# Altium project HyperDrive.PrjPcb (part 1 of 2)
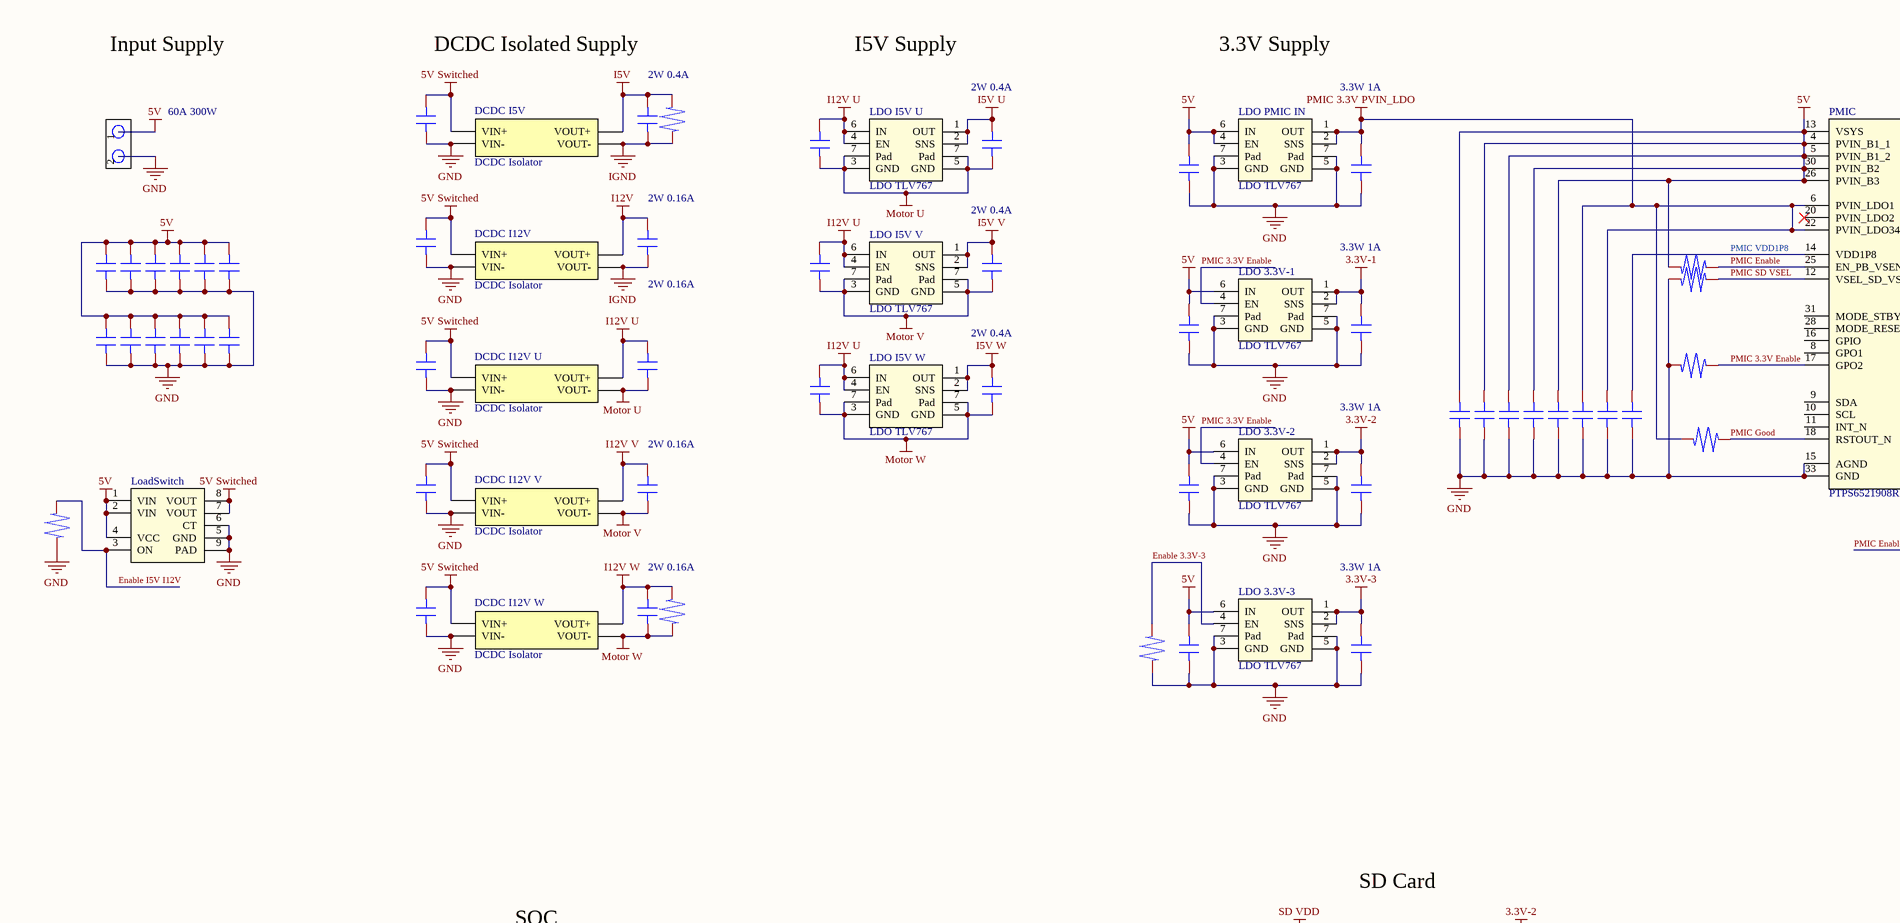
[diagram p0: HyperDrive.SchDoc, top left]
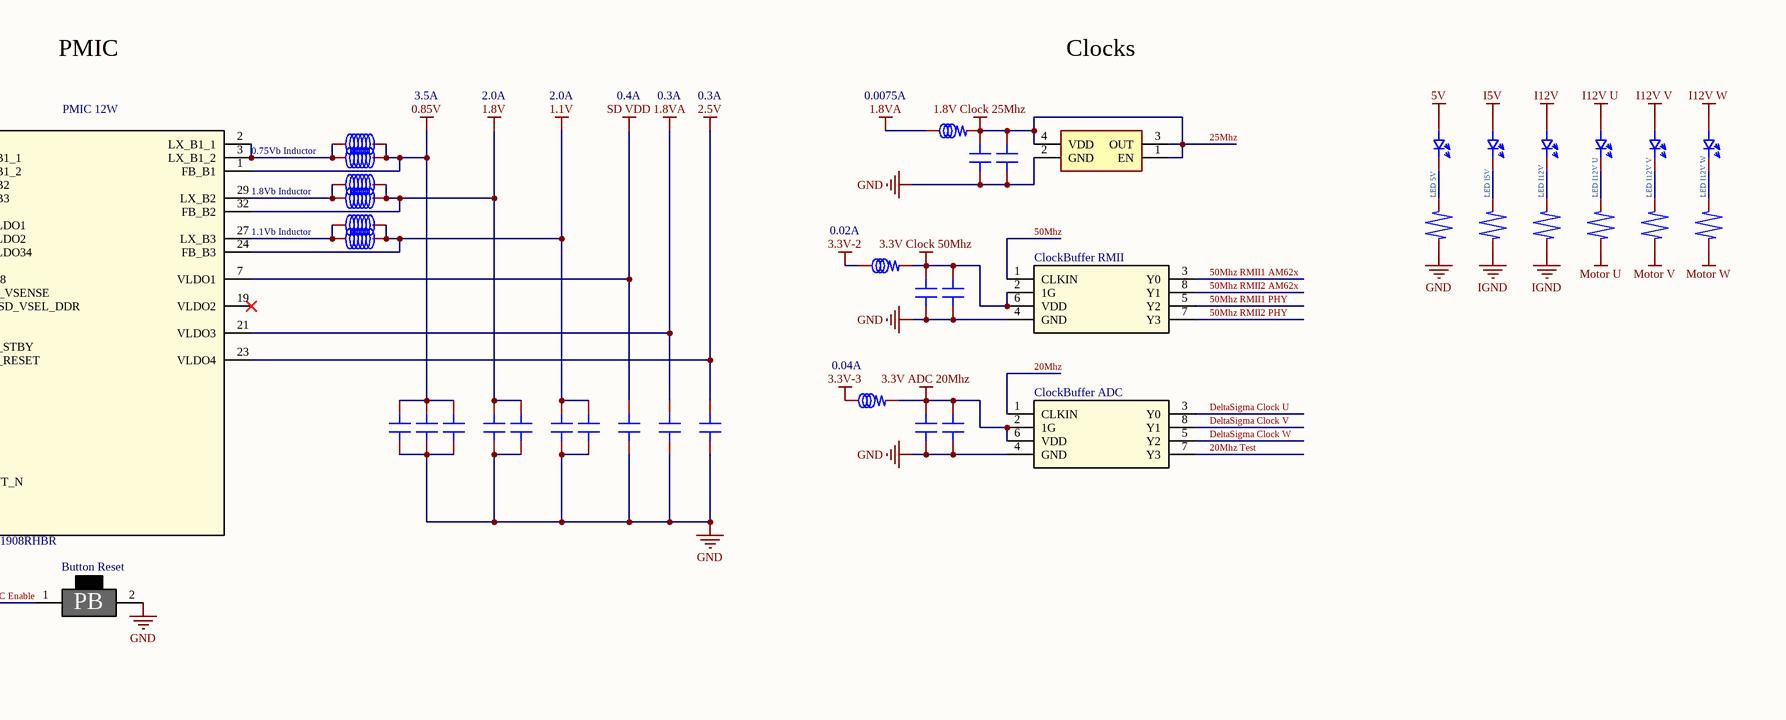
[diagram p1: HyperDrive.SchDoc, top right]
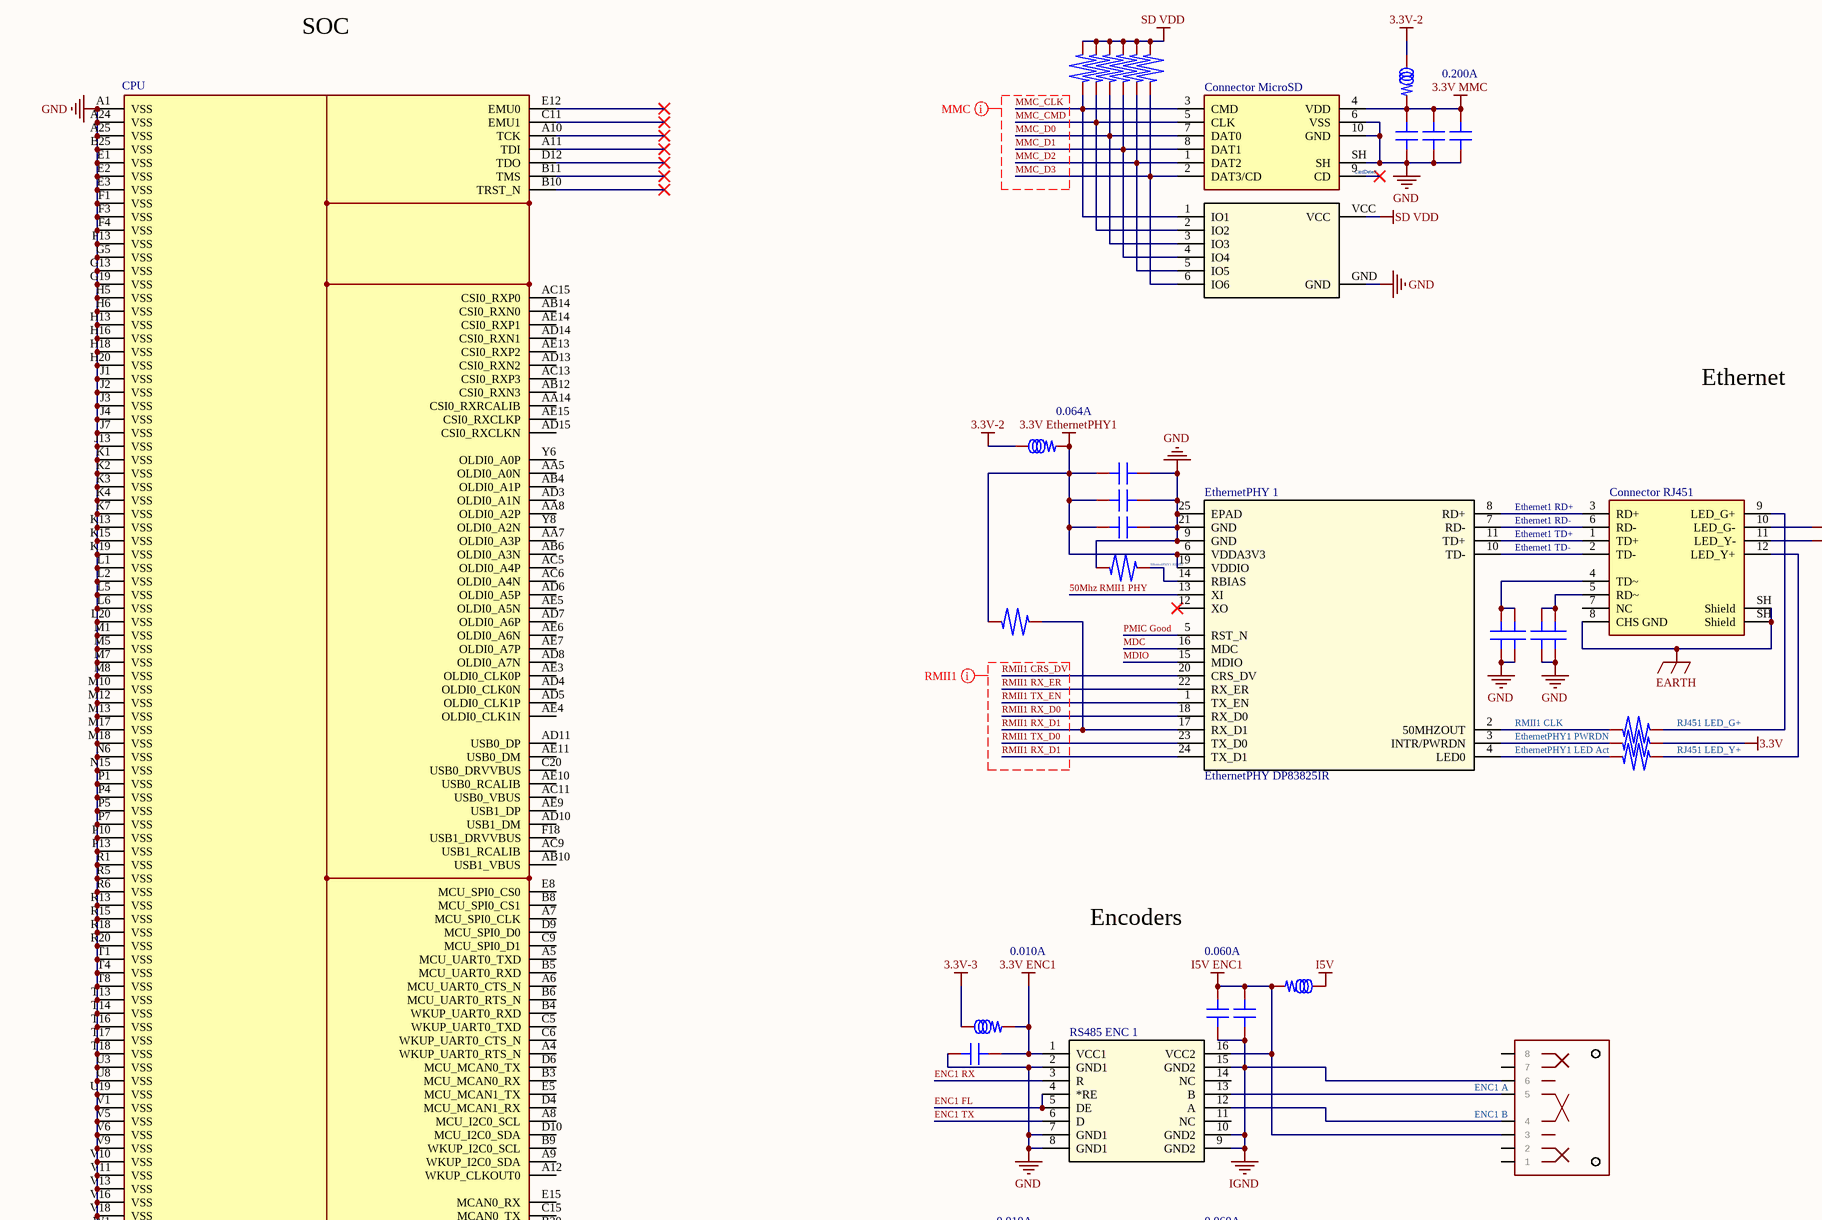
[diagram p2: HyperDrive.SchDoc, centre left]
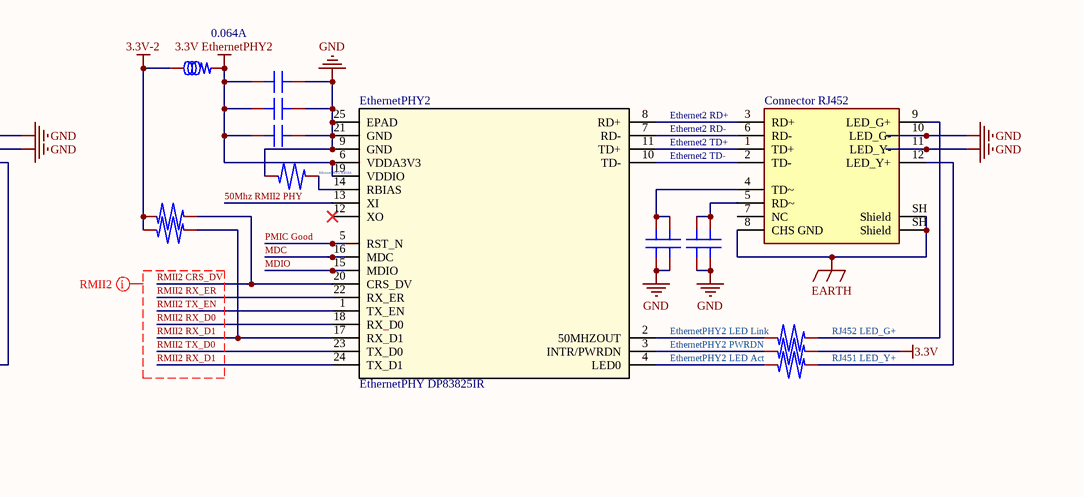
[diagram p3: HyperDrive.SchDoc, centre right]
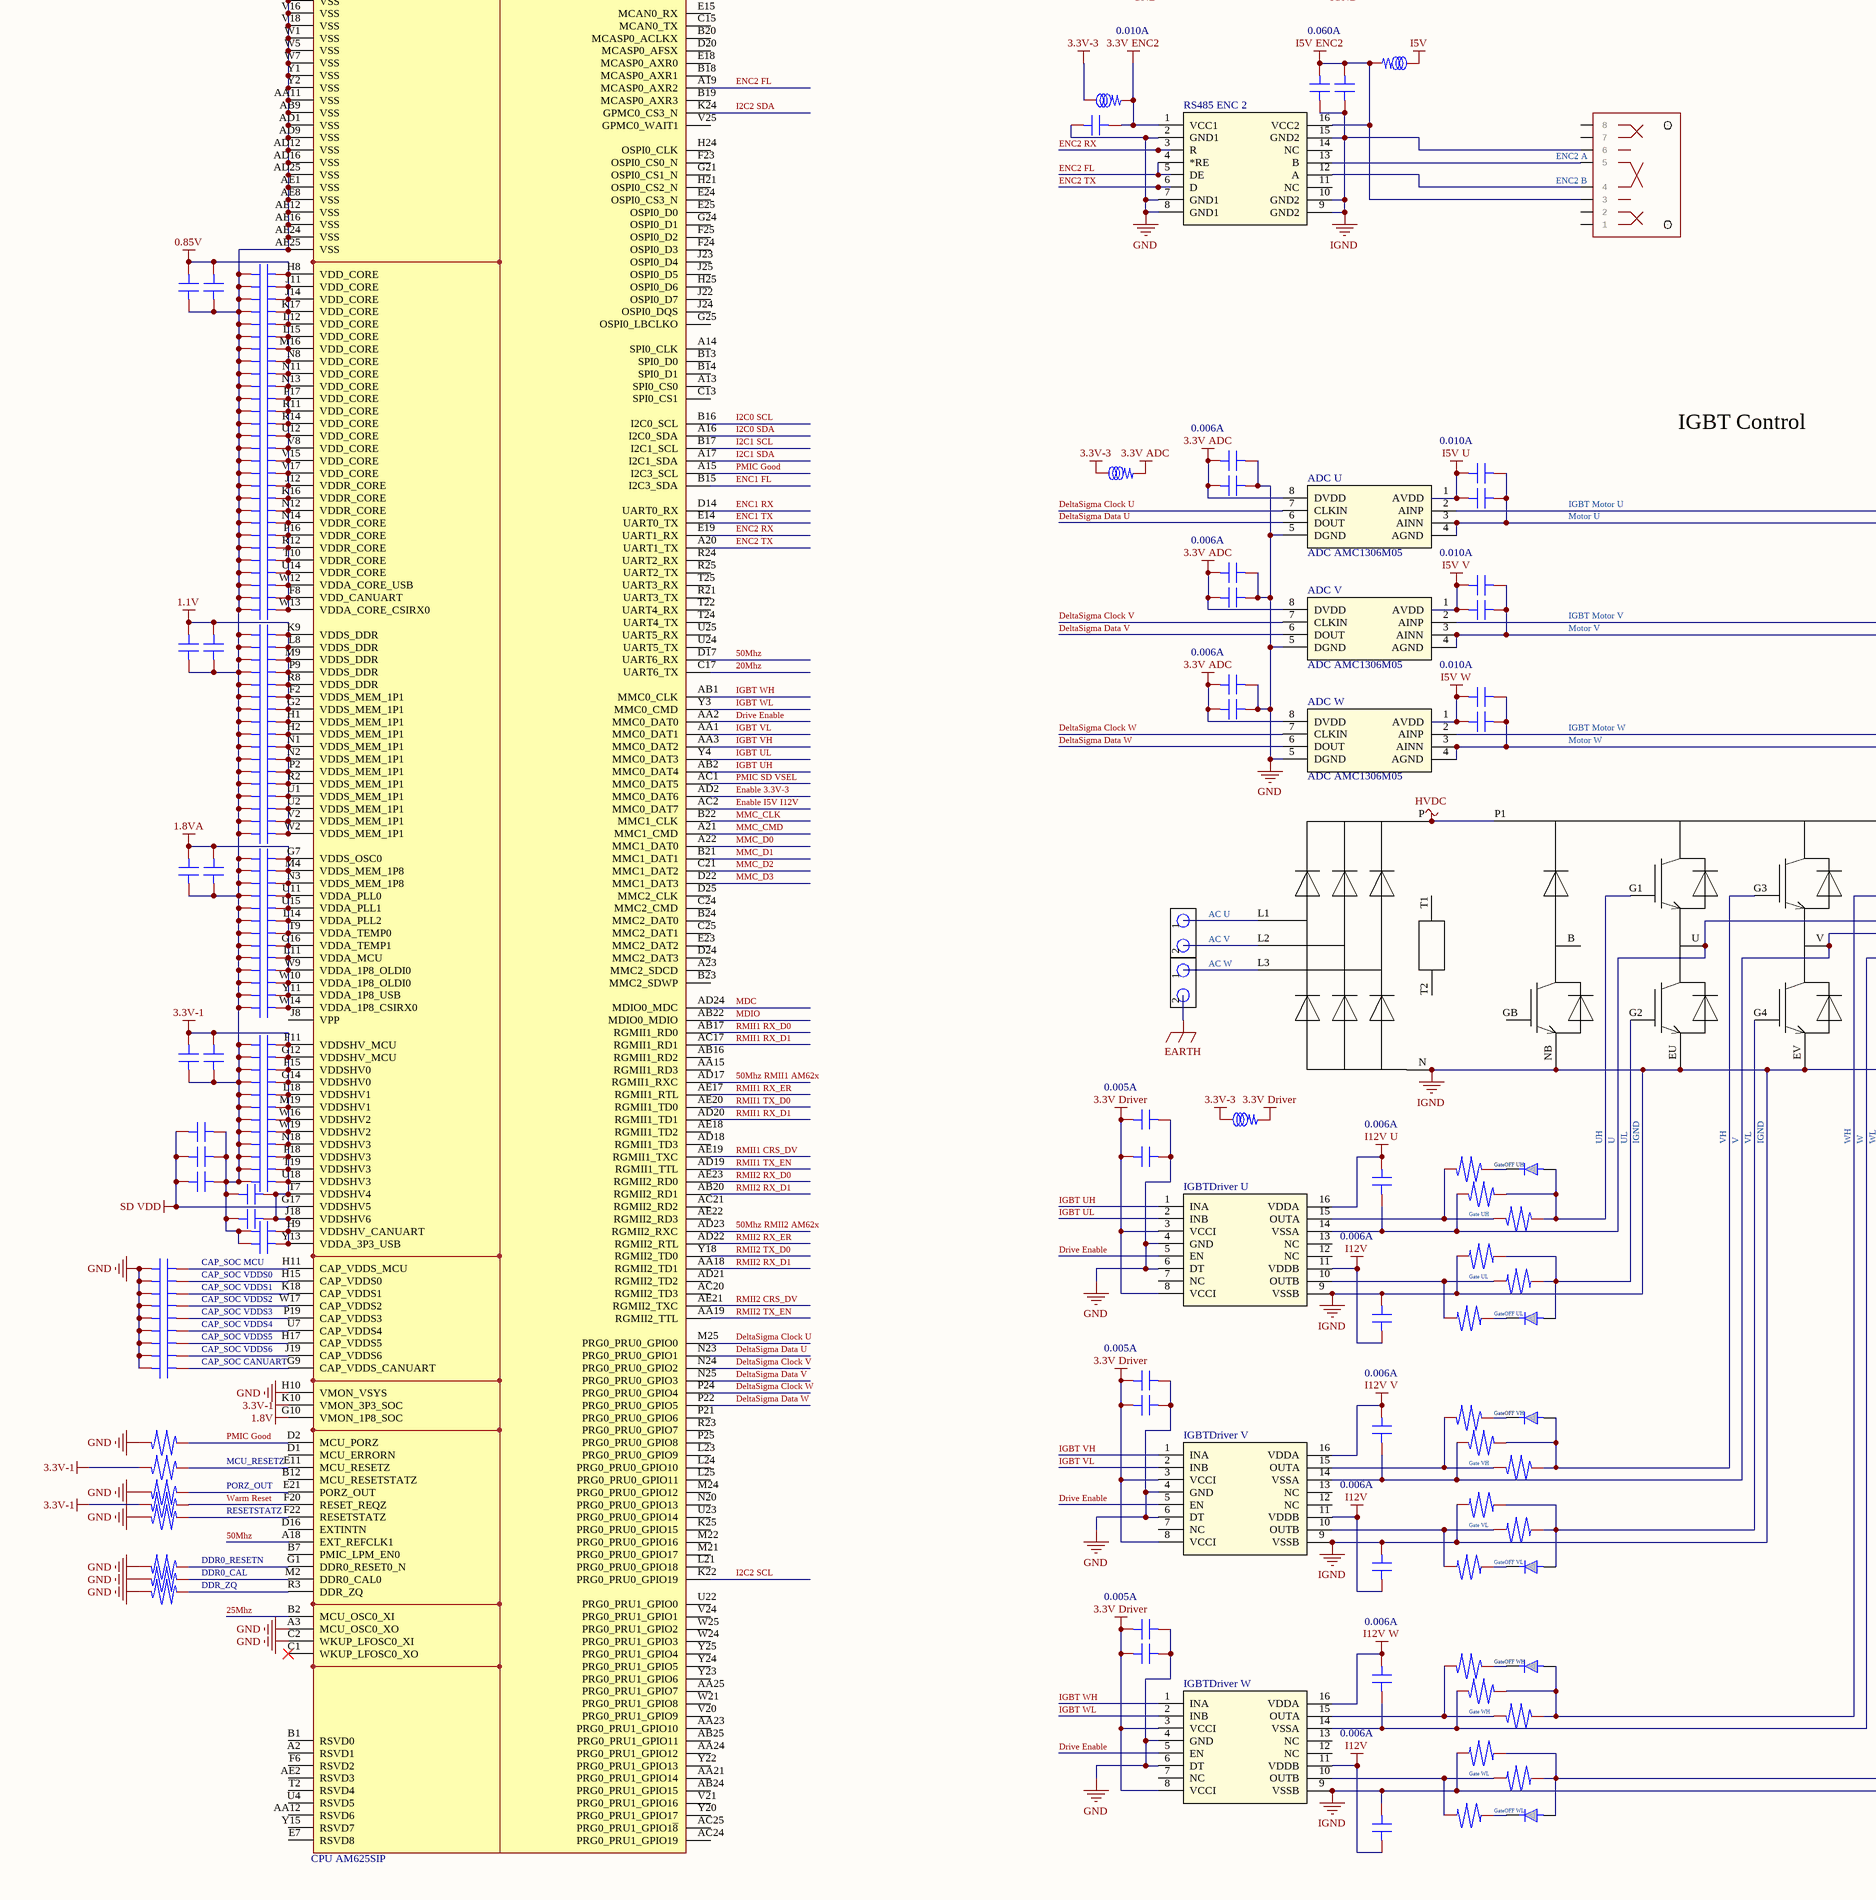
[diagram p4: HyperDrive.SchDoc, bottom left]
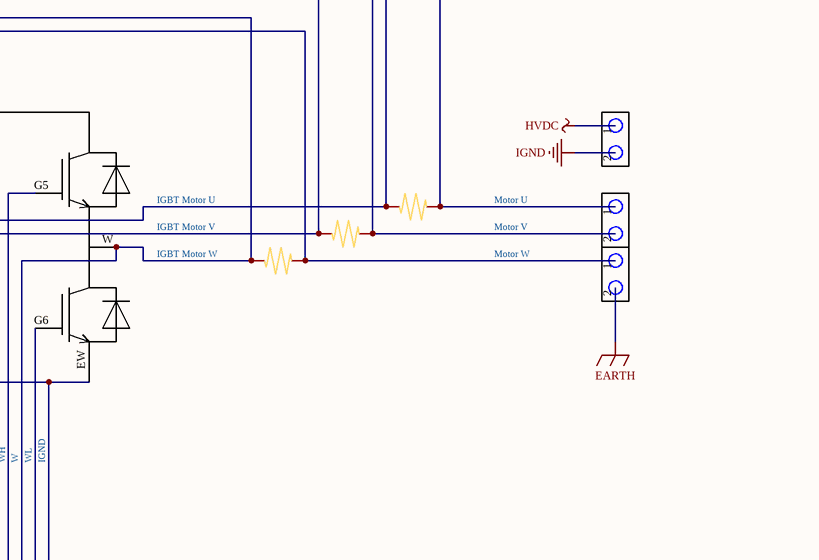
[diagram p5: HyperDrive.SchDoc, bottom right]
1 sheet, 333 parts. Net scope: global (net labels, ports and power ports of the same name join across sheets).
Board file: HyperDrive.PcbDoc

## Sheet HyperDrive.SchDoc
size A0 portrait; SheetNumber: 1; SheetTotal: 1

### Parts
ADC_U  ADC AMC1306M05  [AMC1306M05]
ADC_V  ADC AMC1306M05  [AMC1306M05]
ADC_W  ADC AMC1306M05  [AMC1306M05]
Button_Reset  Button  [PushButton PBS-06-112-25]  (value not drawn)
C_0.85V_1uF  1uF  [Capacitor 1005(0402)]  (value not drawn)
C_0.85V_10uF  10uF  [Capacitor 1005(0402)]  (value not drawn)
C_1.1V_1uF  1uF  [Capacitor 2012(0805)]  (value not drawn)
C_1.1V_10uF  10uF  [Capacitor 2012(0805)]  (value not drawn)
C_1.8V_1uF  1uF  [Capacitor 2012(0805)]  (value not drawn)
C_1.8V_10uF  10uF  [Capacitor 2012(0805)]  (value not drawn)
C_1.8V_Crystal-1  0.1uF  [Capacitor 2012(0805)]  (value not drawn)
C_1.8V_Crystal-2  1uF  [Capacitor 2012(0805)]  (value not drawn)
C_3.3V_1uF  1uF  [Capacitor 2012(0805)]  (value not drawn)
C_3.3V_10uF  10uF  [Capacitor 2012(0805)]  (value not drawn)
C_ADC_U-1  0.1uF  [Capacitor 2012(0805)]  (value not drawn)
C_ADC_U-2  1uF  [Capacitor 2012(0805)]  (value not drawn)
C_ADC_U-3  0.1uF  [Capacitor 2012(0805)]  (value not drawn)
C_ADC_U-4  1uF  [Capacitor 2012(0805)]  (value not drawn)
C_ADC_V-1  1uF  [Capacitor 2012(0805)]  (value not drawn)
C_ADC_V-2  0.1uF  [Capacitor 2012(0805)]  (value not drawn)
C_ADC_V-3  0.1uF  [Capacitor 2012(0805)]  (value not drawn)
C_ADC_V-4  1uF  [Capacitor 2012(0805)]  (value not drawn)
C_ADC_W-1  1uF  [Capacitor 2012(0805)]  (value not drawn)
C_ADC_W-2  0.1uF  [Capacitor 2012(0805)]  (value not drawn)
C_ADC_W-3  0.1uF  [Capacitor 2012(0805)]  (value not drawn)
C_ADC_W-4  1uF  [Capacitor 2012(0805)]  (value not drawn)
C_Backup-1  22uF  [Capacitor 2012(0805)]  (value not drawn)
C_Backup-2  22uF  [Capacitor 2012(0805)]  (value not drawn)
C_Backup-3  22uF  [Capacitor 2012(0805)]  (value not drawn)
C_Backup-4  22uF  [Capacitor 2012(0805)]  (value not drawn)
C_Backup-5  22uF  [Capacitor 2012(0805)]  (value not drawn)
C_Backup-6  22uF  [Capacitor 2012(0805)]  (value not drawn)
C_Backup-7  22uF  [Capacitor 2012(0805)]  (value not drawn)
C_Backup-8  22uF  [Capacitor 2012(0805)]  (value not drawn)
C_Backup-9  22uF  [Capacitor 2012(0805)]  (value not drawn)
C_Backup-10  22uF  [Capacitor 2012(0805)]  (value not drawn)
C_Backup-11  22uF  [Capacitor 2012(0805)]  (value not drawn)
C_Backup-12  22uF  [Capacitor 2012(0805)]  (value not drawn)
C_CAP_SOC_MCU  1uF  [Capacitor 2012(0805)]  (value not drawn)
C_CAP_SOC_VDDS0  1uF  [Capacitor 2012(0805)]  (value not drawn)
C_CAP_SOC_VDDS1  1uF  [Capacitor 2012(0805)]  (value not drawn)
C_CAP_SOC_VDDS2  1uF  [Capacitor 2012(0805)]  (value not drawn)
C_CAP_SOC_VDDS3  1uF  [Capacitor 2012(0805)]  (value not drawn)
C_CAP_SOC_VDDS4  1uF  [Capacitor 2012(0805)]  (value not drawn)
C_CAP_SOC_VDDS5  1uF  [Capacitor 2012(0805)]  (value not drawn)
C_CAP_SOC_VDDS6  1uF  [Capacitor 2012(0805)]  (value not drawn)
C_CAP_SOC_VDDS_CANUART  1uF  [Capacitor 2012(0805)]  (value not drawn)
C_ClockBuffer-1  0.1uF  [Capacitor 2012(0805)]  (value not drawn)
C_ClockBuffer-2  1uF  [Capacitor 2012(0805)]  (value not drawn)
C_ClockBuffer_RMII-1  0.1uF  [Capacitor 2012(0805)]  (value not drawn)
C_ClockBuffer_RMII-2  1uF  [Capacitor 2012(0805)]  (value not drawn)
C_DCDC_I5V_IN  4.7uF  [Capacitor 2012(0805)]  (value not drawn)
C_DCDC_I5V_OUT  10uF  [Capacitor 2012(0805)]  (value not drawn)
C_DCDC_I9V_IN  4.7uF  [Capacitor 2012(0805)]  (value not drawn)
C_DCDC_I9V_OUT  4.7uF  [Capacitor 2012(0805)]  (value not drawn)
C_DCDC_I9V_U_IN  4.7uF  [Capacitor 2012(0805)]  (value not drawn)
C_DCDC_I9V_V_IN  4.7uF  [Capacitor 2012(0805)]  (value not drawn)
C_DCDC_I9V_V_OUT  4.7uF  [Capacitor 2012(0805)]  (value not drawn)
C_DCDC_I9V_W_IN  4.7uF  [Capacitor 2012(0805)]  (value not drawn)
C_DCDC_I9V_W_OUT  4.7uF  [Capacitor 2012(0805)]  (value not drawn)
C_DCDCI_9V_U_OUT  4.7uF  [Capacitor 2012(0805)]  (value not drawn)
C_Driver_UH  1uF  [Capacitor 2012(0805)]  (value not drawn)
C_Driver_UL  1uF  [Capacitor 2012(0805)]  (value not drawn)
C_Driver_VH  1uF  [Capacitor 2012(0805)]  (value not drawn)
C_Driver_VL  1uF  [Capacitor 2012(0805)]  (value not drawn)
C_Driver_WH  1uF  [Capacitor 2012(0805)]  (value not drawn)
C_Driver_WL  1uF  [Capacitor 2012(0805)]  (value not drawn)
C_DriverU-1  0.1uF  [Capacitor 2012(0805)]  (value not drawn)
C_DriverU-2  1uF  [Capacitor 2012(0805)]  (value not drawn)
C_DriverV-1  0.1uF  [Capacitor 2012(0805)]  (value not drawn)
C_DriverV-2  1uF  [Capacitor 2012(0805)]  (value not drawn)
C_DriverW-1  0.1uF  [Capacitor 2012(0805)]  (value not drawn)
C_DriverW-2  1uF  [Capacitor 2012(0805)]  (value not drawn)
C_ENC1_VCC1  1uF  [Capacitor 2012(0805)]  (value not drawn)
C_ENC1_VCC2-1  0.1uF  [Capacitor 2012(0805)]  (value not drawn)
C_ENC1_VCC2-2  1uF  [Capacitor 2012(0805)]  (value not drawn)
C_ENC2_VCC1  1uF  [Capacitor 2012(0805)]  (value not drawn)
C_ENC2_VCC2-1  0.1uF  [Capacitor 2012(0805)]  (value not drawn)
C_ENC2_VCC2-2  1uF  [Capacitor 2012(0805)]  (value not drawn)
C_EthernetPHY1-1  10uF  [Capacitor 2012(0805)]  (value not drawn)
C_EthernetPHY1-2  1uF  [Capacitor 2012(0805)]  (value not drawn)
C_EthernetPHY1-3  0.1uF  [Capacitor 2012(0805)]  (value not drawn)
C_EthernetPHY2-1  10uF  [Capacitor 2012(0805)]  (value not drawn)
C_EthernetPHY2-2  1uF  [Capacitor 2012(0805)]  (value not drawn)
C_EthernetPHY2-3  0.1uF  [Capacitor 2012(0805)]  (value not drawn)
C_LDO_3.3V-1_IN  1uF  [Capacitor 2012(0805)]  (value not drawn)
C_LDO_3.3V-1_OUT  10uF  [Capacitor 2012(0805)]  (value not drawn)
C_LDO_3.3V-2_IN  1uF  [Capacitor 2012(0805)]  (value not drawn)
C_LDO_3.3V-2_OUT  10uF  [Capacitor 2012(0805)]  (value not drawn)
C_LDO_3.3V-3_IN  1uF  [Capacitor 2012(0805)]  (value not drawn)
C_LDO_3.3V-3_OUT  10uF  [Capacitor 2012(0805)]  (value not drawn)
C_LDO_I9V_U_IN  1uF  [Capacitor 2012(0805)]  (value not drawn)
C_LDO_I9V_U_OUT  10uF  [Capacitor 2012(0805)]  (value not drawn)
C_LDO_I9V_V_IN  1uF  [Capacitor 2012(0805)]  (value not drawn)
C_LDO_I9V_V_OUT  10uF  [Capacitor 2012(0805)]  (value not drawn)
C_LDO_I9V_W_IN  1uF  [Capacitor 2012(0805)]  (value not drawn)
C_LDO_I9V_W_OUT  10uF  [Capacitor 2012(0805)]  (value not drawn)
C_LDO_PMIC_IN  1uF  [Capacitor 2012(0805)]  (value not drawn)
C_LDO_PMIC_OUT  10uF  [Capacitor 2012(0805)]  (value not drawn)
C_MMC-1  0.1uF  [Capacitor 2012(0805)]  (value not drawn)
C_MMC-2  1uF  [Capacitor 2012(0805)]  (value not drawn)
C_MMC-3  1uF  [Capacitor 2012(0805)]  (value not drawn)
C_PMIC_0.85V-1  22uF  [Capacitor 2012(0805)]  (value not drawn)
C_PMIC_0.85V-2  22uF  [Capacitor 2012(0805)]  (value not drawn)
C_PMIC_0.85V_0.1uF  0.1uF  [Capacitor 2012(0805)]  (value not drawn)
C_PMIC_1.1V-1  22uF  [Capacitor 2012(0805)]  (value not drawn)
C_PMIC_1.1V-2  22uF  [Capacitor 2012(0805)]  (value not drawn)
C_PMIC_1.8V*  2.2uF  [Capacitor 2012(0805)]  (value not drawn)
C_PMIC_1.8V-1  22uF  [Capacitor 2012(0805)]  (value not drawn)
C_PMIC_1.8V-2  22uF  [Capacitor 2012(0805)]  (value not drawn)
C_PMIC_2.5V  2.2uF  [Capacitor 2012(0805)]  (value not drawn)
C_PMIC_InternalBypass  2.2uF  [Capacitor 2012(0805)]  (value not drawn)
C_PMIC_SD_VDD  2.2uF  [Capacitor 2012(0805)]  (value not drawn)
C_PMIC_VIN_B1_1  4.7uF  [Capacitor 2012(0805)]  (value not drawn)
C_PMIC_VIN_B1_2  4.7uF  [Capacitor 2012(0805)]  (value not drawn)
C_PMIC_VIN_B2  4.7uF  [Capacitor 2012(0805)]  (value not drawn)
C_PMIC_VIN_B3  4.7uF  [Capacitor 2012(0805)]  (value not drawn)
C_PMIC_VIN_LDO1  2.2uF  [Capacitor 2012(0805)]  (value not drawn)
C_PMIC_VIN_LDO34  4.7uF  [Capacitor 2012(0805)]  (value not drawn)
C_PMIC_VSYS  1uF  [Capacitor 2012(0805)]  (value not drawn)
C_RJ451_RD1  1uF  [Capacitor 2012(0805)]  (value not drawn)
C_RJ451_RD2  0.1uF  [Capacitor 2012(0805)]  (value not drawn)
C_RJ451_TD1  1uF  [Capacitor 2012(0805)]  (value not drawn)
C_RJ451_TD2  0.1uF  [Capacitor 2012(0805)]  (value not drawn)
C_RJ452_RD1  1uF  [Capacitor 2012(0805)]  (value not drawn)
C_RJ452_RD2  0.1uF  [Capacitor 2012(0805)]  (value not drawn)
C_RJ452_TD1  1uF  [Capacitor 2012(0805)]  (value not drawn)
C_RJ452_TD2  0.1uF  [Capacitor 2012(0805)]  (value not drawn)
C_SD_VDD_1uF  1uF  [Capacitor 2012(0805)]  (value not drawn)
C_SD_VDD_10uF  10uF  [Capacitor 2012(0805)]  (value not drawn)
C_VDD_CANUART  0.1uF  [Capacitor 1005(0402)]  (value not drawn)
C_VDD_CORE_1  0.1uF  [Capacitor 1005(0402)]  (value not drawn)
C_VDD_CORE_2  0.1uF  [Capacitor 1005(0402)]  (value not drawn)
C_VDD_CORE_3  0.1uF  [Capacitor 1005(0402)]  (value not drawn)
C_VDD_CORE_4  0.1uF  [Capacitor 1005(0402)]  (value not drawn)
C_VDD_CORE_5  0.1uF  [Capacitor 1005(0402)]  (value not drawn)
C_VDD_CORE_6  0.1uF  [Capacitor 1005(0402)]  (value not drawn)
C_VDD_CORE_7  0.1uF  [Capacitor 1005(0402)]  (value not drawn)
C_VDD_CORE_8  0.1uF  [Capacitor 1005(0402)]  (value not drawn)
C_VDD_CORE_9  0.1uF  [Capacitor 1005(0402)]  (value not drawn)
C_VDD_CORE_10  0.1uF  [Capacitor 1005(0402)]  (value not drawn)
C_VDD_CORE_11  0.1uF  [Capacitor 1005(0402)]  (value not drawn)
C_VDD_CORE_12  0.1uF  [Capacitor 1005(0402)]  (value not drawn)
C_VDD_CORE_13  0.1uF  [Capacitor 1005(0402)]  (value not drawn)
C_VDD_CORE_14  0.1uF  [Capacitor 1005(0402)]  (value not drawn)
C_VDD_CORE_15  0.1uF  [Capacitor 1005(0402)]  (value not drawn)
C_VDD_CORE_16  0.1uF  [Capacitor 1005(0402)]  (value not drawn)
C_VDD_CORE_17  0.1uF  [Capacitor 1005(0402)]  (value not drawn)
C_VDDA_1P8_CSIRX0  0.1uF  [Capacitor 2012(0805)]  (value not drawn)
C_VDDA_1P8_OLDI_1  0.1uF  [Capacitor 2012(0805)]  (value not drawn)
C_VDDA_1P8_OLDI_2  0.1uF  [Capacitor 2012(0805)]  (value not drawn)
C_VDDA_1P8_USB  0.1uF  [Capacitor 2012(0805)]  (value not drawn)
C_VDDA_CORE_CSIRX0  0.1uF  [Capacitor 1005(0402)]  (value not drawn)
C_VDDA_CORE_USB  0.1uF  [Capacitor 1005(0402)]  (value not drawn)
C_VDDA_MCU  0.1uF  [Capacitor 2012(0805)]  (value not drawn)
C_VDDA_OSC0  0.1uF  [Capacitor 2012(0805)]  (value not drawn)
C_VDDA_PLL0  0.1uF  [Capacitor 2012(0805)]  (value not drawn)
C_VDDA_PLL1  0.1uF  [Capacitor 2012(0805)]  (value not drawn)
C_VDDA_PLL2  0.1uF  [Capacitor 2012(0805)]  (value not drawn)
C_VDDA_TEMP0  0.1uF  [Capacitor 2012(0805)]  (value not drawn)
C_VDDA_TEMP1  0.1uF  [Capacitor 2012(0805)]  (value not drawn)
C_VDDR_CORE_1  0.1uF  [Capacitor 1005(0402)]  (value not drawn)
C_VDDR_CORE_2  0.1uF  [Capacitor 1005(0402)]  (value not drawn)
C_VDDR_CORE_3  0.1uF  [Capacitor 1005(0402)]  (value not drawn)
C_VDDR_CORE_4  0.1uF  [Capacitor 1005(0402)]  (value not drawn)
C_VDDR_CORE_5  0.1uF  [Capacitor 1005(0402)]  (value not drawn)
C_VDDR_CORE_6  0.1uF  [Capacitor 1005(0402)]  (value not drawn)
C_VDDR_CORE_7  0.1uF  [Capacitor 1005(0402)]  (value not drawn)
C_VDDR_CORE_8  0.1uF  [Capacitor 1005(0402)]  (value not drawn)
C_VDDS_DDR1  0.1uF  [Capacitor 2012(0805)]  (value not drawn)
C_VDDS_DDR2  0.1uF  [Capacitor 2012(0805)]  (value not drawn)
C_VDDS_DDR3  0.1uF  [Capacitor 2012(0805)]  (value not drawn)
C_VDDS_DDR4  0.1uF  [Capacitor 2012(0805)]  (value not drawn)
C_VDDS_DDR5  0.1uF  [Capacitor 2012(0805)]  (value not drawn)
C_VDDS_MEM1  0.1uF  [Capacitor 2012(0805)]  (value not drawn)
C_VDDS_MEM2  0.1uF  [Capacitor 2012(0805)]  (value not drawn)
C_VDDS_MEM3  0.1uF  [Capacitor 2012(0805)]  (value not drawn)
C_VDDS_MEM4  0.1uF  [Capacitor 2012(0805)]  (value not drawn)
C_VDDS_MEM5  0.1uF  [Capacitor 2012(0805)]  (value not drawn)
C_VDDS_MEM6  0.1uF  [Capacitor 2012(0805)]  (value not drawn)
C_VDDS_MEM7  0.1uF  [Capacitor 2012(0805)]  (value not drawn)
C_VDDS_MEM8  0.1uF  [Capacitor 2012(0805)]  (value not drawn)
C_VDDS_MEM9  0.1uF  [Capacitor 2012(0805)]  (value not drawn)
C_VDDS_MEM10  0.1uF  [Capacitor 2012(0805)]  (value not drawn)
C_VDDS_MEM11  0.1uF  [Capacitor 2012(0805)]  (value not drawn)
C_VDDS_MEM12  0.1uF  [Capacitor 2012(0805)]  (value not drawn)
C_VDDS_MEM_1P8_1  0.1uF  [Capacitor 2012(0805)]  (value not drawn)
C_VDDS_MEM_1P8_2  0.1uF  [Capacitor 2012(0805)]  (value not drawn)
C_VDDSHV0_1  0.1uF  [Capacitor 2012(0805)]  (value not drawn)
C_VDDSHV0_2  0.1uF  [Capacitor 2012(0805)]  (value not drawn)
C_VDDSHV1_1  0.1uF  [Capacitor 2012(0805)]  (value not drawn)
C_VDDSHV1_2  0.1uF  [Capacitor 2012(0805)]  (value not drawn)
C_VDDSHV2_1  0.1uF  [Capacitor 2012(0805)]  (value not drawn)
C_VDDSHV2_2  0.1uF  [Capacitor 2012(0805)]  (value not drawn)
C_VDDSHV3_1  0.1uF  [Capacitor 2012(0805)]  (value not drawn)
C_VDDSHV3_2  0.1uF  [Capacitor 2012(0805)]  (value not drawn)
C_VDDSHV3_3  0.1uF  [Capacitor 2012(0805)]  (value not drawn)
C_VDDSHV3_4  0.1uF  [Capacitor 2012(0805)]  (value not drawn)
C_VDDSHV4  0.1uF  [Capacitor 2012(0805)]  (value not drawn)
C_VDDSHV5  0.1uF  [Capacitor 2012(0805)]  (value not drawn)
C_VDDSHV6  0.1uF  [Capacitor 2012(0805)]  (value not drawn)
C_VDDSHV_3P3_USB  0.1uF  [Capacitor 2012(0805)]  (value not drawn)
C_VDDSHV_MCU_0  0.1uF  [Capacitor 2012(0805)]  (value not drawn)
C_VDDSHV_MCU_1  0.1uF  [Capacitor 2012(0805)]  (value not drawn)
C_VDDSHVCANUART  0.1uF  [Capacitor 2012(0805)]  (value not drawn)
ClockBuffer_ADC  Clock Buffer LMK1C1104  [LMK1C1104PWR]  (value not drawn)
ClockBuffer_RMII  Clock Buffer LMK1C1104  [LMK1C1104PWR]  (value not drawn)
Connector_5V_Main  Connector Terminal Screw 5.08mm  [Terminal Screw 5.08mm]  (value not drawn)
Connector_AC_UV  Connector Terminal Screw 5.08mm  [Terminal Screw 5.08mm]  (value not drawn)
Connector_AC_WN  Connector Terminal Screw 5.08mm  [Terminal Screw 5.08mm]  (value not drawn)
Connector_ENC1  Connector RJ45  [RJ45-8P8C Generic]  (value not drawn)
Connector_ENC2  Connector RJ45  [RJ45-8P8C Generic]  (value not drawn)
Connector_HVDC  Connector Terminal Screw 5.08mm  [Terminal Screw 5.08mm]  (value not drawn)
Connector_MicroSD  Connector MUP-M018  [MicroSD MUP-M018]  (value not drawn)
Connector_MOTOR_UV  Connector Terminal Screw 5.08mm  [Terminal Screw 5.08mm]  (value not drawn)
Connector_MOTOR_WE  Connector Terminal Screw 5.08mm  [Terminal Screw 5.08mm]  (value not drawn)
Connector_RJ451  Connector HR911105A  [RJ45 HR911105A]  (value not drawn)
Connector_RJ452  Connector HR911105A  [RJ45 HR911105A]  (value not drawn)
CPU  CPU AM625SIP  [AM625SIP]
D_GateOFF_UH  40V 1A  [1N5819HW]  (value not drawn)
D_GateOFF_UL  40V 1A  [1N5819HW]  (value not drawn)
D_GateOFF_VH  40V 1A  [1N5819HW]  (value not drawn)
D_GateOFF_VL  40V 1A  [1N5819HW]  (value not drawn)
D_GateOFF_WH  40V 1A  [1N5819HW]  (value not drawn)
D_GateOFF_WL  40V 1A  [1N5819HW]  (value not drawn)
DCDC_I5V  DCDC Isolator  [HiLink DCDC 2W]
DCDC_I12V  DCDC Isolator  [HiLink DCDC 2W]
DCDC_I12V_U  DCDC Isolator  [HiLink DCDC 2W]
DCDC_I12V_V  DCDC Isolator  [HiLink DCDC 2W]
DCDC_I12V_W  DCDC Isolator  [HiLink DCDC 2W]
ESD  (no value)  [ESD 6Channel UQFN]
EthernetPHY1_PWRDWN  6.49K 1%  [Resistor 2012(0805)]  (value not drawn)
EthernetPHY2  EthernetPHY DP83825IR  [DP83825IRMQR]
EthernetPHY_1  EthernetPHY DP83825IR  [DP83825IRMQR]
F_1.8V_Crystal  Ferrite  [Ferrite 2012(0805)]  (value not drawn)
F_ADC  120E  [Ferrite 2012(0805)]  (value not drawn)
F_ADC?  120E  [Ferrite 2012(0805)]  (value not drawn)
F_ClockBuffer_RMII  120E  [Ferrite 2012(0805)]  (value not drawn)
F_Driver  120E  [Ferrite 2012(0805)]  (value not drawn)
F_ENC1_VCC1  120E  [Ferrite 2012(0805)]  (value not drawn)
F_ENC1_VCC2  120E  [Ferrite 2012(0805)]  (value not drawn)
F_ENC2_VCC1  120E  [Ferrite 2012(0805)]  (value not drawn)
F_ENC2_VCC2  120E  [Ferrite 2012(0805)]  (value not drawn)
F_EthernetPHY1  120E  [Ferrite 2012(0805)]  (value not drawn)
F_EthernetPHY2  Ferrite  [Ferrite 2012(0805)]  (value not drawn)
F_EthernetPHY?  120E  [Ferrite 2012(0805)]  (value not drawn)
IGBT  Infineon FP30R06W1E3  [FP30R06W1E3]  (value not drawn)
IGBTDriver_U  IGBTDriver UCC21551ADWR  [UCC21551ADWR]  (value not drawn)
IGBTDriver_V  IGBTDriver UCC21551ADWR  [UCC21551ADWR]  (value not drawn)
IGBTDriver_W  IGBTDriver UCC21551ADWR  [UCC21551ADWR]  (value not drawn)
L_PMIC_Buck1-1  1uH 5.14A 0.011Ohm  [INDUCTOR 6.0x6.0x4.5]  (value not drawn)
L_PMIC_Buck1-2  1uH 5.14A 0.011Ohm  [INDUCTOR 6.0x6.0x4.5]  (value not drawn)
L_PMIC_Buck2-1  1uH 5.14A 0.011Ohm  [INDUCTOR 6.0x6.0x4.5]  (value not drawn)
L_PMIC_Buck2-2  1uH 5.14A 0.011Ohm  [INDUCTOR 6.0x6.0x4.5]  (value not drawn)
L_PMIC_Buck3-1  1uH 5.14A 0.011Ohm  [INDUCTOR 6.0x6.0x4.5]  (value not drawn)
L_PMIC_Buck3-2  1uH 5.14A 0.011Ohm  [INDUCTOR 6.0x6.0x4.5]  (value not drawn)
LDO_3.3V-1  LDO TLV767  [TLV767xxDRVR]
LDO_3.3V-2  LDO TLV767  [TLV767xxDRVR]
LDO_3.3V-3  LDO TLV767  [TLV767xxDRVR]
LDO_I5V_U  LDO TLV767  [TLV767xxDRVR]
LDO_I5V_V  LDO TLV767  [TLV767xxDRVR]
LDO_I5V_W  LDO TLV767  [TLV767xxDRVR]
LDO_PMIC_IN  LDO TLV767  [TLV767xxDRVR]
LED_5V  Red  [LED 2012(0805)]  (value not drawn)
LED_I5V  Blue  [LED 2012(0805)]  (value not drawn)
LED_I12V  Blue  [LED 2012(0805)]  (value not drawn)
LED_I12V_U  Blue  [LED 2012(0805)]  (value not drawn)
LED_I12V_V  Blue  [LED 2012(0805)]  (value not drawn)
LED_I12V_W  Blue  [LED 2012(0805)]  (value not drawn)
LoadSwitch  LoadSwitch TPS22975DSGR  [TPS22975DSGR]  (value not drawn)
PMIC  PTPS6521908RHBR  [PMIC TPS6521901RHBR]
R_DDR0_CAL0  240E 1%  [Resistor 2012(0805)]  (value not drawn)
R_DDR_RESET  240E 1%  [Resistor 2012(0805)]  (value not drawn)
R_DDRZQ  240E 1%  [Resistor 2012(0805)]  (value not drawn)
R_EthernetPHY1_LED_Act  6.49K 1%  [Resistor 2012(0805)]  (value not drawn)
R_EthernetPHY1_LED_Link  6.49K 1%  [Resistor 2012(0805)]  (value not drawn)
R_EthernetPHY2_LED_Act  6.49K 1%  [Resistor 2012(0805)]  (value not drawn)
R_EthernetPHY2_LED_Link  6.49K 1%  [Resistor 2012(0805)]  (value not drawn)
R_EthernetPHY2_PWRDN  6.49K 1%  [Resistor 2012(0805)]  (value not drawn)
R_GATE_PullDown_UH  (no value)  [Resistor 2012(0805)]
R_GATE_PullDown_UL  (no value)  [Resistor 2012(0805)]
R_GATE_PullDown_VH  (no value)  [Resistor 2012(0805)]
R_GATE_PullDown_VL  (no value)  [Resistor 2012(0805)]
R_GATE_PullDown_WH  (no value)  [Resistor 2012(0805)]
R_GATE_PullDown_WL  (no value)  [Resistor 2012(0805)]
R_GateOFF_UH  (no value)  [Resistor 2012(0805)]
R_GateOFF_UL  (no value)  [Resistor 2012(0805)]
R_GateOFF_VH  (no value)  [Resistor 2012(0805)]
R_GateOFF_VL  (no value)  [Resistor 2012(0805)]
R_GateOFF_WH  (no value)  [Resistor 2012(0805)]
R_GateOFF_WL  (no value)  [Resistor 2012(0805)]
R_GateON_UH  (no value)  [Resistor 2012(0805)]
R_GateON_UL  (no value)  [Resistor 2012(0805)]
R_GateON_VH  (no value)  [Resistor 2012(0805)]
R_GateON_VL  (no value)  [Resistor 2012(0805)]
R_GateON_WH  (no value)  [Resistor 2012(0805)]
R_GateON_WL  (no value)  [Resistor 2012(0805)]
R_I5V_Preload  50E  [Resistor 2012(0805)]  (value not drawn)
R_I9V_W_Preload  Resistor  [Resistor 2012(0805)]  (value not drawn)
R_LDO3.3V-3_Pulldown_Enable  10K  [Resistor 2012(0805)]  (value not drawn)
R_LED_5V  150E  [Resistor 2012(0805)]  (value not drawn)
R_LED_I5V  82E  [Resistor 2012(0805)]  (value not drawn)
R_LED_I12V  82E  [Resistor 2012(0805)]  (value not drawn)
R_LED_I12V_U  82E  [Resistor 2012(0805)]  (value not drawn)
R_LED_I12V_V  82E  [Resistor 2012(0805)]  (value not drawn)
R_LED_I12V_W  82E  [Resistor 2012(0805)]  (value not drawn)
R_LoadSwitch_Pulldown_Enable  10K  [Resistor 2012(0805)]  (value not drawn)
R_MCU_PORZ  240E 1%  [Resistor 2012(0805)]  (value not drawn)
R_MCU_RESETZ  240E 1%  [Resistor 2012(0805)]  (value not drawn)
R_MMC_PULLUP_CLK  10K  [Resistor 2012(0805)]  (value not drawn)
R_MMC_PULLUP_CMD  10K  [Resistor 2012(0805)]  (value not drawn)
R_MMC_PULLUP_D0  10K  [Resistor 2012(0805)]  (value not drawn)
R_MMC_PULLUP_D1  10K  [Resistor 2012(0805)]  (value not drawn)
R_MMC_PULLUP_D2  10K  [Resistor 2012(0805)]  (value not drawn)
R_MMC_PULLUP_D3  10K  [Resistor 2012(0805)]  (value not drawn)
R_PMIC_Pulldown_3.3V_ENable  10K  [Resistor 2012(0805)]  (value not drawn)
R_PMIC_Pulldown_Enable  4.7K  [Resistor 2012(0805)]  (value not drawn)
R_PMIC_Pulldown_SD_VSEL  10K  [Resistor 2012(0805)]  (value not drawn)
R_PMIC_PulldownGood  10K  [Resistor 2012(0805)]  (value not drawn)
R_PORZ_OUT  240E 1%  [Resistor 2012(0805)]  (value not drawn)
R_RBIAS_EthernetPHY1  6.49K 1%  [Resistor 2012(0805)]  (value not drawn)
R_RBIAS_EthernetPHY2  6.49K 1%  [Resistor 2012(0805)]  (value not drawn)
R_RESET_REQZ  240E 1%  [Resistor 2012(0805)]  (value not drawn)
R_RESETSTATZ  240E 1%  [Resistor 2012(0805)]  (value not drawn)
RMII1_Strap_Master  2.49K  [Resistor 2012(0805)]  (value not drawn)
RMII2_Strap_Address_1  2.49K  [Resistor 2012(0805)]  (value not drawn)
RMII2_Strap_Master  2.49K  [Resistor 2012(0805)]  (value not drawn)
RS485_ENC_1  RS485 ISO3088  [ISO3088]  (value not drawn)
RS485_ENC_2  RS485 ISO3088  [ISO3088]  (value not drawn)
Shunt_U  Shunt Resistor  [CG FL-U 40A]  (value not drawn)
Shunt_V  Shunt Resistor  [CG FL-U 40A]  (value not drawn)
Shunt_W  Shunt Resistor  [CG FL-U 40A]  (value not drawn)
X_25Mz_AM62x  Crystal CMOS  [LMK6CE02500DDLER]  (value not drawn)

### Nets
0.85V: C_0.85V_1uF.2 C_0.85V_10uF.2 C_PMIC_0.85V-1.2 C_PMIC_0.85V-2.2 C_PMIC_0.85V_0.1uF.2 C_VDD_CANUART.2 C_VDD_CORE_1.2 C_VDD_CORE_2.2 C_VDD_CORE_3.2 C_VDD_CORE_4.2 C_VDD_CORE_5.2 C_VDD_CORE_6.2 C_VDD_CORE_7.2 C_VDD_CORE_8.2 C_VDD_CORE_9.2 C_VDD_CORE_10.2 C_VDD_CORE_11.2 C_VDD_CORE_12.2 C_VDD_CORE_13.2 C_VDD_CORE_14.2 C_VDD_CORE_15.2 C_VDD_CORE_16.2 C_VDD_CORE_17.2 C_VDDA_CORE_CSIRX0.2 C_VDDA_CORE_USB.2 C_VDDR_CORE_1.2 C_VDDR_CORE_2.2 C_VDDR_CORE_3.2 C_VDDR_CORE_4.2 C_VDDR_CORE_5.2 C_VDDR_CORE_6.2 C_VDDR_CORE_7.2 C_VDDR_CORE_8.2 CPU.F8(VDD_CANUART) CPU.H8(VDD_CORE) CPU.J11(VDD_CORE) CPU.J12(VDDR_CORE) CPU.J14(VDD_CORE) CPU.K16(VDDR_CORE) CPU.K17(VDD_CORE) CPU.L12(VDD_CORE) CPU.L15(VDD_CORE) CPU.M16(VDD_CORE) CPU.N8(VDD_CORE) CPU.N11(VDD_CORE) CPU.N12(VDDR_CORE) CPU.N13(VDD_CORE) CPU.N14(VDDR_CORE) CPU.P16(VDDR_CORE) CPU.P17(VDD_CORE) CPU.R11(VDD_CORE) CPU.R12(VDDR_CORE) CPU.R14(VDD_CORE) CPU.T10(VDDR_CORE) CPU.U12(VDD_CORE) CPU.U14(VDDR_CORE) CPU.V8(VDD_CORE) CPU.V15(VDD_CORE) CPU.V17(VDD_CORE) CPU.W12(VDDA_CORE_USB) CPU.W13(VDDA_CORE_CSIRX0) L_PMIC_Buck1-1.2 L_PMIC_Buck1-2.2 PMIC.1(FB_B1)
1.1V: C_1.1V_1uF.2 C_1.1V_10uF.2 C_PMIC_1.1V-1.2 C_PMIC_1.1V-2.2 C_VDDS_DDR1.2 C_VDDS_DDR2.2 C_VDDS_DDR3.2 C_VDDS_DDR4.2 C_VDDS_DDR5.2 C_VDDS_MEM1.2 C_VDDS_MEM2.2 C_VDDS_MEM3.2 C_VDDS_MEM4.2 C_VDDS_MEM5.2 C_VDDS_MEM6.2 C_VDDS_MEM7.2 C_VDDS_MEM8.2 C_VDDS_MEM9.2 C_VDDS_MEM10.2 C_VDDS_MEM11.2 C_VDDS_MEM12.2 CPU.F2(VDDS_MEM_1P1) CPU.G2(VDDS_MEM_1P1) CPU.H1(VDDS_MEM_1P1) CPU.H2(VDDS_MEM_1P1) CPU.K9(VDDS_DDR) CPU.L8(VDDS_DDR) CPU.M9(VDDS_DDR) CPU.N1(VDDS_MEM_1P1) CPU.N2(VDDS_MEM_1P1) CPU.P2(VDDS_MEM_1P1) CPU.P9(VDDS_DDR) CPU.R2(VDDS_MEM_1P1) CPU.R8(VDDS_DDR) CPU.U1(VDDS_MEM_1P1) CPU.U2(VDDS_MEM_1P1) CPU.V2(VDDS_MEM_1P1) CPU.W2(VDDS_MEM_1P1) L_PMIC_Buck3-1.2 L_PMIC_Buck3-2.2 PMIC.24(FB_B3)
1.8V: C_PMIC_1.8V-1.2 C_PMIC_1.8V-2.2 CPU.G10(VMON_1P8_SOC) L_PMIC_Buck2-1.2 L_PMIC_Buck2-2.2 PMIC.32(FB_B2)
1.8VA: C_1.8V_1uF.2 C_1.8V_10uF.2 C_PMIC_1.8V*.2 C_VDDA_1P8_CSIRX0.2 C_VDDA_1P8_OLDI_1.2 C_VDDA_1P8_OLDI_2.2 C_VDDA_1P8_USB.2 C_VDDA_MCU.2 C_VDDA_OSC0.2 C_VDDA_PLL0.2 C_VDDA_PLL1.2 C_VDDA_PLL2.2 C_VDDA_TEMP0.2 C_VDDA_TEMP1.2 C_VDDS_MEM_1P8_1.2 C_VDDS_MEM_1P8_2.2 CPU.G7(VDDS_OSC0) CPU.G16(VDDA_TEMP1) CPU.L11(VDDA_MCU) CPU.L14(VDDA_PLL2) CPU.M4(VDDS_MEM_1P8) CPU.N3(VDDS_MEM_1P8) CPU.T9(VDDA_TEMP0) CPU.U11(VDDA_PLL0) CPU.U15(VDDA_PLL1) CPU.W9(VDDA_1P8_OLDI0) CPU.W10(VDDA_1P8_OLDI0) CPU.W14(VDDA_1P8_CSIRX0) CPU.Y11(VDDA_1P8_USB) F_1.8V_Crystal.1 PMIC.21(VLDO3)
2.5V: C_PMIC_2.5V.2 PMIC.23(VLDO4)
3.3V: EthernetPHY1_PWRDWN.1 R_EthernetPHY2_PWRDN.1
3.3V ADC: ADC_U.8(DVDD) ADC_V.8(DVDD) ADC_W.8(DVDD) C_ADC_U-1.2 C_ADC_U-2.2 C_ADC_V-1.2 C_ADC_V-2.2 C_ADC_W-1.2 C_ADC_W-2.2 F_ADC?.2
3.3V ADC 20Mhz: C_ClockBuffer-1.2 C_ClockBuffer-2.2 ClockBuffer_ADC.2(1G) ClockBuffer_ADC.6(VDD) F_ADC.2
3.3V Clock 50Mhz: C_ClockBuffer_RMII-1.2 C_ClockBuffer_RMII-2.2 ClockBuffer_RMII.2(1G) ClockBuffer_RMII.6(VDD) F_ClockBuffer_RMII.2
3.3V Driver: C_DriverU-1.2 C_DriverU-2.2 C_DriverV-1.2 C_DriverV-2.2 C_DriverW-1.2 C_DriverW-2.2 F_Driver.2 IGBTDriver_U.3(VCCI) IGBTDriver_U.8(VCCI) IGBTDriver_V.3(VCCI) IGBTDriver_V.8(VCCI) IGBTDriver_W.3(VCCI) IGBTDriver_W.8(VCCI)
3.3V ENC1: C_ENC1_VCC1.1 F_ENC1_VCC1.2 RS485_ENC_1.1(VCC1)
3.3V ENC2: C_ENC2_VCC1.1 F_ENC2_VCC1.2 RS485_ENC_2.1(VCC1)
3.3V EthernetPHY1: C_EthernetPHY1-1.2 C_EthernetPHY1-2.1 C_EthernetPHY1-3.1 EthernetPHY_1.6(VDDA3V3) EthernetPHY_1.19(VDDIO) F_EthernetPHY1.2 RMII1_Strap_Master.2
3.3V EthernetPHY2: C_EthernetPHY2-1.1 C_EthernetPHY2-2.1 C_EthernetPHY2-3.1 EthernetPHY2.6(VDDA3V3) EthernetPHY2.19(VDDIO) F_EthernetPHY2.2
3.3V MMC: C_MMC-1.2 C_MMC-2.2 C_MMC-3.2 Connector_MicroSD.4(VDD) F_EthernetPHY?.2
3.3V-1: C_3.3V_1uF.2 C_3.3V_10uF.2 C_LDO_3.3V-1_OUT.2 C_VDDSHV0_1.2 C_VDDSHV0_2.2 C_VDDSHV1_1.2 C_VDDSHV1_2.2 C_VDDSHV2_1.2 C_VDDSHV2_2.2 C_VDDSHV3_1.2 C_VDDSHV3_2.2 C_VDDSHV3_3.2 C_VDDSHV3_4.2 C_VDDSHV4.2 C_VDDSHV6.2 C_VDDSHV_3P3_USB.2 C_VDDSHV_MCU_0.2 C_VDDSHV_MCU_1.2 C_VDDSHVCANUART.2 CPU.F11(VDDSHV_MCU) CPU.F15(VDDSHV0) CPU.G12(VDDSHV_MCU) CPU.G14(VDDSHV0) CPU.H9(VDDSHV_CANUART) CPU.J18(VDDSHV6) CPU.K10(VMON_3P3_SOC) CPU.L18(VDDSHV1) CPU.M19(VDDSHV1) CPU.N18(VDDSHV3) CPU.P18(VDDSHV3) CPU.T7(VDDSHV4) CPU.T19(VDDSHV3) CPU.U18(VDDSHV3) CPU.W16(VDDSHV2) CPU.W19(VDDSHV2) CPU.Y13(VDDA_3P3_USB) LDO_3.3V-1.1(OUT) LDO_3.3V-1.2(SNS) R_MCU_RESETZ.2 R_RESET_REQZ.2
3.3V-2: C_LDO_3.3V-2_OUT.2 F_ClockBuffer_RMII.1 F_EthernetPHY1.1 F_EthernetPHY2.1 F_EthernetPHY?.1 LDO_3.3V-2.1(OUT) LDO_3.3V-2.2(SNS) RMII2_Strap_Address_1.2 RMII2_Strap_Master.2
3.3V-3: C_LDO_3.3V-3_OUT.2 F_ADC.1 F_ADC?.1 F_Driver.1 F_ENC1_VCC1.1 F_ENC2_VCC1.1 LDO_3.3V-3.1(OUT) LDO_3.3V-3.2(SNS)
5V: C_Backup-1.2 C_Backup-2.2 C_Backup-3.2 C_Backup-4.2 C_Backup-5.2 C_Backup-6.2 C_Backup-7.2 C_Backup-8.2 C_Backup-9.2 C_Backup-10.2 C_Backup-11.2 C_Backup-12.2 C_LDO_3.3V-1_IN.2 C_LDO_3.3V-2_IN.2 C_LDO_3.3V-3_IN.2 C_LDO_PMIC_IN.2 C_PMIC_VIN_B1_1.2 C_PMIC_VIN_B1_2.2 C_PMIC_VIN_B2.2 C_PMIC_VIN_B3.2 C_PMIC_VSYS.2 Connector_5V_Main.1 LDO_3.3V-1.6(IN) LDO_3.3V-2.6(IN) LDO_3.3V-3.6(IN) LDO_PMIC_IN.4(EN) LDO_PMIC_IN.6(IN) LED_5V.1 LoadSwitch.1(VIN) LoadSwitch.2(VIN) LoadSwitch.4(VCC) PMIC.4(PVIN_B1_1) PMIC.5(PVIN_B1_2) PMIC.13(VSYS) PMIC.26(PVIN_B3) PMIC.30(PVIN_B2) R_PMIC_Pulldown_Enable.1
5V Switched: C_DCDC_I5V_IN.2 C_DCDC_I9V_IN.2 C_DCDC_I9V_U_IN.2 C_DCDC_I9V_V_IN.2 C_DCDC_I9V_W_IN.2 DCDC_I5V.VIN+ DCDC_I12V.VIN+ DCDC_I12V_U.VIN+ DCDC_I12V_V.VIN+ DCDC_I12V_W.VIN+ LoadSwitch.7(VOUT) LoadSwitch.8(VOUT)
25Mhz: C_1.8V_Crystal-1.2 C_1.8V_Crystal-2.2 CPU.B2(MCU_OSC0_XI) F_1.8V_Crystal.2 X_25Mz_AM62x.1(EN) X_25Mz_AM62x.3(OUT) X_25Mz_AM62x.4(VDD)  [also labelled 1.8V Clock 25Mhz]
EARTH: Connector_AC_WN.2 Connector_MOTOR_WE.2 Connector_RJ451.8(CHS_GND) Connector_RJ451.SH(Shield) Connector_RJ452.8(CHS_GND) Connector_RJ452.SH(Shield)
GND: ADC_U.5(DGND) ADC_V.5(DGND) ADC_W.5(DGND) Button_Reset.2 C_0.85V_1uF.1 C_0.85V_10uF.1 C_1.1V_1uF.1 C_1.1V_10uF.1 C_1.8V_1uF.1 C_1.8V_10uF.1 C_1.8V_Crystal-1.1 C_1.8V_Crystal-2.1 C_3.3V_1uF.1 C_3.3V_10uF.1 C_ADC_U-1.1 C_ADC_U-2.1 C_ADC_V-1.1 C_ADC_V-2.1 C_ADC_W-1.1 C_ADC_W-2.1 C_Backup-1.1 C_Backup-2.1 C_Backup-3.1 C_Backup-4.1 C_Backup-5.1 C_Backup-6.1 C_Backup-7.1 C_Backup-8.1 C_Backup-9.1 C_Backup-10.1 C_Backup-11.1 C_Backup-12.1 C_CAP_SOC_MCU.2 C_CAP_SOC_VDDS0.2 C_CAP_SOC_VDDS1.2 C_CAP_SOC_VDDS2.2 C_CAP_SOC_VDDS3.2 C_CAP_SOC_VDDS4.2 C_CAP_SOC_VDDS5.2 C_CAP_SOC_VDDS6.2 C_CAP_SOC_VDDS_CANUART.2 C_ClockBuffer-1.1 C_ClockBuffer-2.1 C_ClockBuffer_RMII-1.1 C_ClockBuffer_RMII-2.1 C_DCDC_I5V_IN.1 C_DCDC_I9V_IN.1 C_DCDC_I9V_U_IN.1 C_DCDC_I9V_V_IN.1 C_DCDC_I9V_W_IN.1 C_DriverU-1.1 C_DriverU-2.1 C_DriverV-1.1 C_DriverV-2.1 C_DriverW-1.1 C_DriverW-2.1 C_ENC1_VCC1.2 C_ENC2_VCC1.2 C_EthernetPHY1-1.1 C_EthernetPHY1-2.2 C_EthernetPHY1-3.2 C_EthernetPHY2-1.2 C_EthernetPHY2-2.2 C_EthernetPHY2-3.2 C_LDO_3.3V-1_IN.1 C_LDO_3.3V-1_OUT.1 C_LDO_3.3V-2_IN.1 C_LDO_3.3V-2_OUT.1 C_LDO_3.3V-3_IN.1 C_LDO_3.3V-3_OUT.1 C_LDO_PMIC_IN.1 C_LDO_PMIC_OUT.1 C_MMC-1.1 C_MMC-2.1 C_MMC-3.1 C_PMIC_0.85V-1.1 C_PMIC_0.85V-2.1 C_PMIC_0.85V_0.1uF.1 C_PMIC_1.1V-1.1 C_PMIC_1.1V-2.1 C_PMIC_1.8V*.1 C_PMIC_1.8V-1.1 C_PMIC_1.8V-2.1 C_PMIC_2.5V.1 C_PMIC_InternalBypass.1 C_PMIC_SD_VDD.1 C_PMIC_VIN_B1_1.1 C_PMIC_VIN_B1_2.1 C_PMIC_VIN_B2.1 C_PMIC_VIN_B3.1 C_PMIC_VIN_LDO1.1 C_PMIC_VIN_LDO34.1 C_PMIC_VSYS.1 C_RJ451_RD1.1 C_RJ451_RD2.1 C_RJ451_TD1.1 C_RJ451_TD2.1 C_RJ452_RD1.1 C_RJ452_RD2.1 C_RJ452_TD1.1 C_RJ452_TD2.1 C_SD_VDD_1uF.1 C_SD_VDD_10uF.1 C_VDD_CANUART.1 C_VDD_CORE_1.1 C_VDD_CORE_2.1 C_VDD_CORE_3.1 C_VDD_CORE_4.1 C_VDD_CORE_5.1 C_VDD_CORE_6.1 C_VDD_CORE_7.1 C_VDD_CORE_8.1 C_VDD_CORE_9.1 C_VDD_CORE_10.1 C_VDD_CORE_11.1 C_VDD_CORE_12.1 C_VDD_CORE_13.1 C_VDD_CORE_14.1 C_VDD_CORE_15.1 C_VDD_CORE_16.1 C_VDD_CORE_17.1 C_VDDA_1P8_CSIRX0.1 C_VDDA_1P8_OLDI_1.1 C_VDDA_1P8_OLDI_2.1 C_VDDA_1P8_USB.1 C_VDDA_CORE_CSIRX0.1 C_VDDA_CORE_USB.1 C_VDDA_MCU.1 C_VDDA_OSC0.1 C_VDDA_PLL0.1 C_VDDA_PLL1.1 C_VDDA_PLL2.1 C_VDDA_TEMP0.1 C_VDDA_TEMP1.1 C_VDDR_CORE_1.1 C_VDDR_CORE_2.1 C_VDDR_CORE_3.1 C_VDDR_CORE_4.1 C_VDDR_CORE_5.1 C_VDDR_CORE_6.1 C_VDDR_CORE_7.1 C_VDDR_CORE_8.1 C_VDDS_DDR1.1 C_VDDS_DDR2.1 C_VDDS_DDR3.1 C_VDDS_DDR4.1 C_VDDS_DDR5.1 C_VDDS_MEM1.1 C_VDDS_MEM2.1 C_VDDS_MEM3.1 C_VDDS_MEM4.1 C_VDDS_MEM5.1 C_VDDS_MEM6.1 C_VDDS_MEM7.1 C_VDDS_MEM8.1 C_VDDS_MEM9.1 C_VDDS_MEM10.1 C_VDDS_MEM11.1 C_VDDS_MEM12.1 C_VDDS_MEM_1P8_1.1 C_VDDS_MEM_1P8_2.1 C_VDDSHV0_1.1 C_VDDSHV0_2.1 C_VDDSHV1_1.1 C_VDDSHV1_2.1 C_VDDSHV2_1.1 C_VDDSHV2_2.1 C_VDDSHV3_1.1 C_VDDSHV3_2.1 C_VDDSHV3_3.1 C_VDDSHV3_4.1 C_VDDSHV4.1 C_VDDSHV5.1 C_VDDSHV6.1 C_VDDSHV_3P3_USB.1 C_VDDSHV_MCU_0.1 C_VDDSHV_MCU_1.1 C_VDDSHVCANUART.1 ClockBuffer_ADC.4(GND) ClockBuffer_RMII.4(GND) Connector_5V_Main.2 Connector_MicroSD.6(VSS) Connector_MicroSD.10(GND) Connector_MicroSD.SH Connector_RJ451.10(LED_G-) Connector_RJ451.11(LED_Y-) Connector_RJ452.10(LED_G-) Connector_RJ452.11(LED_Y-) CPU.A1(VSS) CPU.A3(MCU_OSC0_XO) CPU.A24(VSS) CPU.A25(VSS) CPU.AA11(VSS) CPU.AB9(VSS) CPU.AD1(VSS) CPU.AD9(VSS) CPU.AD12(VSS) CPU.AD16(VSS) CPU.AD25(VSS) CPU.AE1(VSS) CPU.AE8(VSS) CPU.AE12(VSS) CPU.AE16(VSS) CPU.AE24(VSS) CPU.AE25(VSS) CPU.B25(VSS) CPU.C2(WKUP_LFOSC0_XI) CPU.E1(VSS) CPU.E2(VSS) CPU.E3(VSS) CPU.F1(VSS) CPU.F3(VSS) CPU.F4(VSS) CPU.F13(VSS) CPU.G5(VSS) CPU.G13(VSS) CPU.G19(VSS) CPU.H5(VSS) CPU.H6(VSS) CPU.H10(VMON_VSYS) CPU.H13(VSS) CPU.H16(VSS) CPU.H18(VSS) CPU.H20(VSS) CPU.J1(VSS) CPU.J2(VSS) CPU.J3(VSS) CPU.J4(VSS) CPU.J7(VSS) CPU.J13(VSS) CPU.K1(VSS) CPU.K2(VSS) CPU.K3(VSS) CPU.K4(VSS) CPU.K7(VSS) CPU.K13(VSS) CPU.K15(VSS) CPU.K19(VSS) CPU.L1(VSS) CPU.L2(VSS) CPU.L5(VSS) CPU.L6(VSS) CPU.L20(VSS) CPU.M1(VSS) CPU.M5(VSS) CPU.M7(VSS) CPU.M8(VSS) CPU.M10(VSS) CPU.M12(VSS) CPU.M13(VSS) CPU.M17(VSS) CPU.M18(VSS) CPU.N6(VSS) CPU.N15(VSS) CPU.P1(VSS) CPU.P4(VSS) CPU.P5(VSS) CPU.P7(VSS) CPU.P10(VSS) CPU.P13(VSS) CPU.R1(VSS) CPU.R5(VSS) CPU.R6(VSS) CPU.R13(VSS) CPU.R15(VSS) CPU.R18(VSS) CPU.R20(VSS) CPU.T1(VSS) CPU.T4(VSS) CPU.T8(VSS) CPU.T13(VSS) CPU.T14(VSS) CPU.T16(VSS) CPU.T17(VSS) CPU.T18(VSS) CPU.U3(VSS) CPU.U8(VSS) CPU.U19(VSS) CPU.V1(VSS) CPU.V5(VSS) CPU.V6(VSS) CPU.V9(VSS) CPU.V10(VSS) CPU.V11(VSS) CPU.V13(VSS) CPU.V16(VSS) CPU.V18(VSS) CPU.W1(VSS) CPU.W5(VSS) CPU.W7(VSS) CPU.Y1(VSS) CPU.Y2(VSS) DCDC_I5V.VIN- DCDC_I12V.VIN- DCDC_I12V_U.VIN- DCDC_I12V_V.VIN- DCDC_I12V_W.VIN- ESD.GND EthernetPHY2.9(GND) EthernetPHY2.21(GND) EthernetPHY2.25(EPAD) EthernetPHY_1.9(GND) EthernetPHY_1.21(GND) EthernetPHY_1.25(EPAD) IGBTDriver_U.4(GND) IGBTDriver_U.6(DT) IGBTDriver_V.4(GND) IGBTDriver_V.6(DT) IGBTDriver_W.4(GND) IGBTDriver_W.6(DT) LDO_3.3V-1.3(GND) LDO_3.3V-1.5(GND) LDO_3.3V-1.7(Pad) LDO_3.3V-2.3(GND) LDO_3.3V-2.5(GND) LDO_3.3V-2.7(Pad) LDO_3.3V-3.3(GND) LDO_3.3V-3.5(GND) LDO_3.3V-3.7(Pad) LDO_PMIC_IN.3(GND) LDO_PMIC_IN.5(GND) LDO_PMIC_IN.7(Pad) LoadSwitch.5(GND) LoadSwitch.6(CT) LoadSwitch.9(PAD) PMIC.15(AGND) PMIC.33(GND) R_DDR0_CAL0.2 R_DDR_RESET.2 R_DDRZQ.2 R_LDO3.3V-3_Pulldown_Enable.1 R_LED_5V.1 R_LoadSwitch_Pulldown_Enable.1 R_MCU_PORZ.2 R_PMIC_Pulldown_3.3V_ENable.1 R_PMIC_Pulldown_SD_VSEL.1 R_PORZ_OUT.2 R_RBIAS_EthernetPHY1.2 R_RBIAS_EthernetPHY2.2 R_RESETSTATZ.2 RS485_ENC_1.2(GND1) RS485_ENC_1.7(GND1) RS485_ENC_1.8(GND1) RS485_ENC_2.2(GND1) RS485_ENC_2.7(GND1) RS485_ENC_2.8(GND1) X_25Mz_AM62x.2(GND)
HVDC: Connector_HVDC.1 IGBT.P IGBT.P1
I5V: C_DCDC_I5V_OUT.2 DCDC_I5V.VOUT+ F_ENC1_VCC2.1 F_ENC2_VCC2.1 LED_I5V.1 R_I5V_Preload.2
I5V ENC1: C_ENC1_VCC2-1.1 C_ENC1_VCC2-2.1 Connector_ENC1.3 F_ENC1_VCC2.2 RS485_ENC_1.16(VCC2)
I5V ENC2: C_ENC2_VCC2-1.2 C_ENC2_VCC2-2.2 Connector_ENC2.3 F_ENC2_VCC2.2 RS485_ENC_2.16(VCC2)
I5V U: ADC_U.1(AVDD) C_ADC_U-3.2 C_ADC_U-4.2 C_LDO_I9V_U_OUT.2 LDO_I5V_U.1(OUT) LDO_I5V_U.2(SNS)
I5V V: ADC_V.1(AVDD) C_ADC_V-3.2 C_ADC_V-4.2 C_LDO_I9V_V_OUT.2 LDO_I5V_V.1(OUT) LDO_I5V_V.2(SNS)
I5V W: ADC_W.1(AVDD) C_ADC_W-3.2 C_ADC_W-4.2 C_LDO_I9V_W_OUT.2 LDO_I5V_W.1(OUT) LDO_I5V_W.2(SNS)
I12V: C_DCDC_I9V_OUT.2 C_Driver_UL.2 C_Driver_VL.2 C_Driver_WL.2 DCDC_I12V.VOUT+ IGBTDriver_U.11(VDDB) IGBTDriver_V.11(VDDB) IGBTDriver_W.11(VDDB) LED_I12V.1
I12V U: C_DCDCI_9V_U_OUT.2 C_Driver_UH.1 C_LDO_I9V_U_IN.2 C_LDO_I9V_V_IN.2 C_LDO_I9V_W_IN.2 DCDC_I12V_U.VOUT+ IGBTDriver_U.16(VDDA) LDO_I5V_U.4(EN) LDO_I5V_U.6(IN) LDO_I5V_V.4(EN) LDO_I5V_V.6(IN) LDO_I5V_W.4(EN) LDO_I5V_W.6(IN) LED_I12V_U.1
I12V V: C_DCDC_I9V_V_OUT.2 C_Driver_VH.1 DCDC_I12V_V.VOUT+ IGBTDriver_V.16(VDDA) LED_I12V_V.1
I12V W: C_DCDC_I9V_W_OUT.2 C_Driver_WH.1 DCDC_I12V_W.VOUT+ IGBTDriver_W.16(VDDA) LED_I12V_W.1 R_I9V_W_Preload.2
IGND: C_DCDC_I5V_OUT.1 C_DCDC_I9V_OUT.1 C_Driver_UL.1 C_Driver_VL.1 C_Driver_WL.1 C_ENC1_VCC2-1.2 C_ENC1_VCC2-2.2 C_ENC2_VCC2-1.1 C_ENC2_VCC2-2.1 Connector_ENC1.6 Connector_ENC2.6 Connector_HVDC.2 DCDC_I5V.VOUT- DCDC_I12V.VOUT- IGBT.EU IGBT.EV IGBT.N IGBT.NB IGBTDriver_U.9(VSSB) IGBTDriver_V.9(VSSB) IGBTDriver_W.9(VSSB) R_GATE_PullDown_UL.2 R_GATE_PullDown_VL.2 R_GATE_PullDown_WL.2 R_I5V_Preload.1 R_LED_I5V.1 R_LED_I12V.1 RS485_ENC_1.9(GND2) RS485_ENC_1.10(GND2) RS485_ENC_1.15(GND2) RS485_ENC_2.9(GND2) RS485_ENC_2.10(GND2) RS485_ENC_2.15(GND2)
Motor U: ADC_U.3(AINN) ADC_U.4(AGND) C_ADC_U-3.1 C_ADC_U-4.1 C_DCDCI_9V_U_OUT.1 C_LDO_I9V_U_IN.1 C_LDO_I9V_U_OUT.1 Connector_MOTOR_UV.1 DCDC_I12V_U.VOUT- LDO_I5V_U.3(GND) LDO_I5V_U.5(GND) LDO_I5V_U.7(Pad) R_LED_I12V_U.1 Shunt_U.2
Motor V: ADC_V.3(AINN) ADC_V.4(AGND) C_ADC_V-3.1 C_ADC_V-4.1 C_DCDC_I9V_V_OUT.1 C_LDO_I9V_V_IN.1 C_LDO_I9V_V_OUT.1 Connector_MOTOR_UV.2 DCDC_I12V_V.VOUT- LDO_I5V_V.3(GND) LDO_I5V_V.5(GND) LDO_I5V_V.7(Pad) R_LED_I12V_V.1 Shunt_V.2
Motor W: ADC_W.3(AINN) ADC_W.4(AGND) C_ADC_W-3.1 C_ADC_W-4.1 C_DCDC_I9V_W_OUT.1 C_LDO_I9V_W_IN.1 C_LDO_I9V_W_OUT.1 Connector_MOTOR_WE.1 DCDC_I12V_W.VOUT- LDO_I5V_W.3(GND) LDO_I5V_W.5(GND) LDO_I5V_W.7(Pad) R_I9V_W_Preload.1 R_LED_I12V_W.1 Shunt_W.2
PMIC 3.3V PVIN_LDO: C_LDO_PMIC_OUT.2 C_PMIC_VIN_LDO1.2 C_PMIC_VIN_LDO34.2 LDO_PMIC_IN.1(OUT) LDO_PMIC_IN.2(SNS) PMIC.6(PVIN_LDO1) PMIC.22(PVIN_LDO34) R_PMIC_PulldownGood.1
SD VDD: C_PMIC_SD_VDD.2 C_SD_VDD_1uF.2 C_SD_VDD_10uF.2 C_VDDSHV5.2 CPU.G17(VDDSHV5) ESD.VCC PMIC.7(VLDO1) R_MMC_PULLUP_CLK.1 R_MMC_PULLUP_CMD.1 R_MMC_PULLUP_D0.1 R_MMC_PULLUP_D1.1 R_MMC_PULLUP_D2.1 R_MMC_PULLUP_D3.1
0.75Vb Inductor: L_PMIC_Buck1-1.1 L_PMIC_Buck1-2.1 PMIC.2(LX_B1_1) PMIC.3(LX_B1_2)
1.1Vb Inductor: L_PMIC_Buck3-1.1 L_PMIC_Buck3-2.1 PMIC.27(LX_B3)
1.8Vb Inductor: L_PMIC_Buck2-1.1 L_PMIC_Buck2-2.1 PMIC.29(LX_B2)
20Mhz: ClockBuffer_ADC.1(CLKIN) CPU.C17(UART6_TX)
20Mhz Test: ClockBuffer_ADC.7(Y3)
50Mhz: ClockBuffer_RMII.1(CLKIN) CPU.A18(EXT_REFCLK1) CPU.D17(UART6_RX)
50Mhz RMII1 AM62x: ClockBuffer_RMII.3(Y0) CPU.AD17(RGMII1_RXC)
50Mhz RMII1 PHY: ClockBuffer_RMII.5(Y2) EthernetPHY_1.13(XI)
50Mhz RMII2 AM62x: ClockBuffer_RMII.8(Y1) CPU.AD23(RGMII2_RXC)
50Mhz RMII2 PHY: ClockBuffer_RMII.7(Y3) EthernetPHY2.13(XI)
AC U: Connector_AC_UV.1 IGBT.L1
AC V: Connector_AC_UV.2 IGBT.L2
AC W: Connector_AC_WN.1 IGBT.L3
CAP_SOC CANUART: C_CAP_SOC_VDDS_CANUART.1 CPU.G9(CAP_VDDS_CANUART)
CAP_SOC MCU: C_CAP_SOC_MCU.1 CPU.H11(CAP_VDDS_MCU)
CAP_SOC VDDS0: C_CAP_SOC_VDDS0.1 CPU.H15(CAP_VDDS0)
CAP_SOC VDDS1: C_CAP_SOC_VDDS1.1 CPU.K18(CAP_VDDS1)
CAP_SOC VDDS2: C_CAP_SOC_VDDS2.1 CPU.W17(CAP_VDDS2)
CAP_SOC VDDS3: C_CAP_SOC_VDDS3.1 CPU.P19(CAP_VDDS3)
CAP_SOC VDDS4: C_CAP_SOC_VDDS4.1 CPU.U7(CAP_VDDS4)
CAP_SOC VDDS5: C_CAP_SOC_VDDS5.1 CPU.H17(CAP_VDDS5)
CAP_SOC VDDS6: C_CAP_SOC_VDDS6.1 CPU.J19(CAP_VDDS6)
CardDetect: Connector_MicroSD.9(CD)
DDR0_CAL: CPU.M2(DDR0_CAL0) R_DDR0_CAL0.1
DDR0_RESETN: CPU.G1(DDR0_RESET0_N) R_DDR_RESET.1
DDR_ZQ: CPU.R3(DDR_ZQ) R_DDRZQ.1
DeltaSigma Clock U: ADC_U.7(CLKIN) ClockBuffer_ADC.3(Y0) CPU.M25(PRG0_PRU0_GPIO0)
DeltaSigma Clock V: ADC_V.7(CLKIN) ClockBuffer_ADC.8(Y1) CPU.N24(PRG0_PRU0_GPIO2)
DeltaSigma Clock W: ADC_W.7(CLKIN) ClockBuffer_ADC.5(Y2) CPU.P24(PRG0_PRU0_GPIO4)
DeltaSigma Data U: ADC_U.6(DOUT) CPU.N23(PRG0_PRU0_GPIO1)
DeltaSigma Data V: ADC_V.6(DOUT) CPU.N25(PRG0_PRU0_GPIO3)
DeltaSigma Data W: ADC_W.6(DOUT) CPU.P22(PRG0_PRU0_GPIO5)
Drive Enable: CPU.AA2(MMC0_DAT0) IGBTDriver_U.5(EN) IGBTDriver_V.5(EN) IGBTDriver_W.5(EN)
Enable 3.3V-3: CPU.AD2(MMC0_DAT6) LDO_3.3V-3.4(EN) R_LDO3.3V-3_Pulldown_Enable.2
Enable I5V I12V: CPU.AC2(MMC0_DAT7) LoadSwitch.3(ON) R_LoadSwitch_Pulldown_Enable.2
ENC1 A: Connector_ENC1.5 RS485_ENC_1.13(B)
ENC1 B: Connector_ENC1.4 RS485_ENC_1.12(A)
ENC1 FL: CPU.B15(I2C3_SDA) RS485_ENC_1.4(*RE) RS485_ENC_1.5(DE)
ENC1 RX: CPU.D14(UART0_RX) RS485_ENC_1.3(R)
ENC1 TX: CPU.E14(UART0_TX) RS485_ENC_1.6(D)
ENC2 A: Connector_ENC2.5 RS485_ENC_2.13(B)
ENC2 B: Connector_ENC2.4 RS485_ENC_2.12(A)
ENC2 FL: CPU.A19(MCASP0_AXR2) RS485_ENC_2.4(*RE) RS485_ENC_2.5(DE)
ENC2 RX: CPU.E19(UART1_RX) RS485_ENC_2.3(R)
ENC2 TX: CPU.A20(UART1_TX) RS485_ENC_2.6(D)
Ethernet1 RD+: Connector_RJ451.3(RD+) EthernetPHY_1.8(RD+)
Ethernet1 RD-: Connector_RJ451.6(RD-) EthernetPHY_1.7(RD-)
Ethernet1 TD+: Connector_RJ451.1(TD+) EthernetPHY_1.11(TD+)
Ethernet1 TD-: Connector_RJ451.2(TD-) EthernetPHY_1.10(TD-)
Ethernet2 RD+: Connector_RJ452.3(RD+) EthernetPHY2.8(RD+)
Ethernet2 RD-: Connector_RJ452.6(RD-) EthernetPHY2.7(RD-)
Ethernet2 TD+: Connector_RJ452.1(TD+) EthernetPHY2.11(TD+)
Ethernet2 TD-: Connector_RJ452.2(TD-) EthernetPHY2.10(TD-)
EthernetPHY1 LED Act: EthernetPHY_1.4(LED0) R_EthernetPHY1_LED_Act.2
EthernetPHY1 PWRDN: EthernetPHY1_PWRDWN.2 EthernetPHY_1.3(INTR/PWRDN)
EthernetPHY1 RBIAS: EthernetPHY_1.14(RBIAS) R_RBIAS_EthernetPHY1.1
EthernetPHY2 LED Act: EthernetPHY2.4(LED0) R_EthernetPHY2_LED_Act.2
EthernetPHY2 LED Link: EthernetPHY2.2(50MHZOUT) R_EthernetPHY2_LED_Link.2
EthernetPHY2 PWRDN: EthernetPHY2.3(INTR/PWRDN) R_EthernetPHY2_PWRDN.2
EthernetPHY2 RBIAS: EthernetPHY2.14(RBIAS) R_RBIAS_EthernetPHY2.1
Gate UH: IGBTDriver_U.15(OUTA) R_GateOFF_UH.2 R_GateON_UH.2
Gate UL: IGBTDriver_U.10(OUTB) R_GateOFF_UL.2 R_GateON_UL.2
Gate VH: IGBTDriver_V.15(OUTA) R_GateOFF_VH.2 R_GateON_VH.2
Gate VL: IGBTDriver_V.10(OUTB) R_GateOFF_VL.2 R_GateON_VL.2
Gate WH: IGBTDriver_W.15(OUTA) R_GateOFF_WH.2 R_GateON_WH.2
Gate WL: IGBTDriver_W.10(OUTB) R_GateOFF_WL.2 R_GateON_WL.2
GateOFF UH: D_GateOFF_UH.1(K) R_GateOFF_UH.1
GateOFF UL: D_GateOFF_UL.1(K) R_GateOFF_UL.1
GateOFF VH: D_GateOFF_VH.1(K) R_GateOFF_VH.1
GateOFF VL: D_GateOFF_VL.1(K) R_GateOFF_VL.1
GateOFF WH: D_GateOFF_WH.1(K) R_GateOFF_WH.1
GateOFF WL: D_GateOFF_WL.1(K) R_GateOFF_WL.1
I2C0 SCL: CPU.B16(I2C0_SCL)
I2C0 SDA: CPU.A16(I2C0_SDA)
I2C1 SCL: CPU.B17(I2C1_SCL)
I2C1 SDA: CPU.A17(I2C1_SDA)
I2C2 SCL: CPU.K22(PRG0_PRU0_GPIO19)
I2C2 SDA: CPU.K24(GPMC0_CS3_N)
IGBT Motor U: ADC_U.2(AINP) C_Driver_UH.2 IGBT.U IGBTDriver_U.14(VSSA) R_GATE_PullDown_UH.2 Shunt_U.1  [also labelled U]
IGBT Motor V: ADC_V.2(AINP) C_Driver_VH.2 IGBT.V IGBTDriver_V.14(VSSA) R_GATE_PullDown_VH.2 Shunt_V.1  [also labelled V]
IGBT Motor W: ADC_W.2(AINP) C_Driver_WH.2 IGBT.W IGBTDriver_W.14(VSSA) R_GATE_PullDown_WH.2 Shunt_W.1  [also labelled W]
IGBT UH: CPU.AB2(MMC0_DAT4) IGBTDriver_U.1(INA)
IGBT UL: CPU.Y4(MMC0_DAT3) IGBTDriver_U.2(INB)
IGBT VH: CPU.AA3(MMC0_DAT2) IGBTDriver_V.1(INA)
IGBT VL: CPU.AA1(MMC0_DAT1) IGBTDriver_V.2(INB)
IGBT WH: CPU.AB1(MMC0_CLK) IGBTDriver_W.1(INA)
IGBT WL: CPU.Y3(MMC0_CMD) IGBTDriver_W.2(INB)
LED 5V: LED_5V.2 R_LED_5V.2
LED I5V: LED_I5V.2 R_LED_I5V.2
LED I12V: LED_I12V.2 R_LED_I12V.2
LED I12V U: LED_I12V_U.2 R_LED_I12V_U.2
LED I12V V: LED_I12V_V.2 R_LED_I12V_V.2
LED I12V W: LED_I12V_W.2 R_LED_I12V_W.2
MCU_RESETZ: CPU.E11(MCU_RESETZ) R_MCU_RESETZ.1
MDC: CPU.AD24(MDIO0_MDC) EthernetPHY2.16(MDC) EthernetPHY_1.16(MDC)
MDIO: CPU.AB22(MDIO0_MDIO) EthernetPHY2.15(MDIO) EthernetPHY_1.15(MDIO)
MMC_CLK: Connector_MicroSD.3(CMD) CPU.B22(MMC1_CLK) ESD.1(IO1) R_MMC_PULLUP_CMD.2
MMC_CMD: Connector_MicroSD.5(CLK) CPU.A21(MMC1_CMD) ESD.2(IO2) R_MMC_PULLUP_CLK.2
MMC_D0: Connector_MicroSD.7(DAT0) CPU.A22(MMC1_DAT0) ESD.3(IO3) R_MMC_PULLUP_D0.2
MMC_D1: Connector_MicroSD.8(DAT1) CPU.B21(MMC1_DAT1) ESD.4(IO4) R_MMC_PULLUP_D1.2
MMC_D2: Connector_MicroSD.1(DAT2) CPU.C21(MMC1_DAT2) ESD.5(IO5) R_MMC_PULLUP_D2.2
MMC_D3: Connector_MicroSD.2(DAT3/CD) CPU.D22(MMC1_DAT3) ESD.6(IO6) R_MMC_PULLUP_D3.2
PMIC 3.3V Enable: LDO_3.3V-1.4(EN) LDO_3.3V-2.4(EN) PMIC.17(GPO2) R_PMIC_Pulldown_3.3V_ENable.2
PMIC Enable: Button_Reset.1 PMIC.25(EN_PB_VSENSE) R_PMIC_Pulldown_Enable.2
PMIC Good: CPU.A15(I2C3_SCL) CPU.D2(MCU_PORZ) EthernetPHY2.5(RST_N) EthernetPHY_1.5(RST_N) PMIC.18(RSTOUT_N) R_MCU_PORZ.1 R_PMIC_PulldownGood.2
PMIC SD VSEL: CPU.AC1(MMC0_DAT5) PMIC.12(VSEL_SD_VSEL_DDR) R_PMIC_Pulldown_SD_VSEL.2
PMIC VDD1P8: C_PMIC_InternalBypass.2 PMIC.14(VDD1P8)
PORZ_OUT: CPU.E21(PORZ_OUT) R_PORZ_OUT.1
RESETSTATZ: CPU.F22(RESETSTATZ) R_RESETSTATZ.1
RJ451 LED_G+: Connector_RJ451.9(LED_G+) R_EthernetPHY1_LED_Link.1
RJ451 LED_Y+: Connector_RJ451.12(LED_Y+) Connector_RJ452.12(LED_Y+) R_EthernetPHY1_LED_Act.1 R_EthernetPHY2_LED_Act.1
RJ452 LED_G+: Connector_RJ452.9(LED_G+) R_EthernetPHY2_LED_Link.1
RMII1 CLK: EthernetPHY_1.2(50MHZOUT) R_EthernetPHY1_LED_Link.2
RMII1 CRS_DV: CPU.AE19(RGMII1_TXC) EthernetPHY_1.20(CRS_DV)
RMII1 RX_D0: CPU.AB17(RGMII1_RD0) EthernetPHY_1.18(RX_D0)
RMII1 RX_D1: CPU.AC17(RGMII1_RD1) CPU.AD20(RGMII1_TD1) EthernetPHY_1.17(RX_D1) EthernetPHY_1.24(TX_D1) RMII1_Strap_Master.1
RMII1 RX_ER: CPU.AE17(RGMII1_RTL) EthernetPHY_1.22(RX_ER)
RMII1 TX_D0: CPU.AE20(RGMII1_TD0) EthernetPHY_1.23(TX_D0)
RMII1 TX_EN: CPU.AD19(RGMII1_TTL) EthernetPHY_1.1(TX_EN)
RMII2 CRS_DV: CPU.AE21(RGMII2_TXC) EthernetPHY2.20(CRS_DV) RMII2_Strap_Address_1.1
RMII2 RX_D0: CPU.AE23(RGMII2_RD0) EthernetPHY2.18(RX_D0)
RMII2 RX_D1: CPU.AA18(RGMII2_TD1) CPU.AB20(RGMII2_RD1) EthernetPHY2.17(RX_D1) EthernetPHY2.24(TX_D1) RMII2_Strap_Master.1
RMII2 RX_ER: CPU.AD22(RGMII2_RTL) EthernetPHY2.22(RX_ER)
RMII2 TX_D0: CPU.Y18(RGMII2_TD0) EthernetPHY2.23(TX_D0)
RMII2 TX_EN: CPU.AA19(RGMII2_TTL) EthernetPHY2.1(TX_EN)
UH: D_GateOFF_UH.2(A) IGBT.G1 R_GATE_PullDown_UH.1 R_GateON_UH.1
UL: D_GateOFF_UL.2(A) IGBT.G2 R_GATE_PullDown_UL.1 R_GateON_UL.1
VH: D_GateOFF_VH.2(A) IGBT.G3 R_GATE_PullDown_VH.1 R_GateON_VH.1
VL: D_GateOFF_VL.2(A) IGBT.G4 R_GATE_PullDown_VL.1 R_GateON_VL.1
Warm Reset: CPU.F20(RESET_REQZ) R_RESET_REQZ.1
WH: D_GateOFF_WH.2(A) IGBT.G5 R_GATE_PullDown_WH.1 R_GateON_WH.1
WL: D_GateOFF_WL.2(A) IGBT.G6 R_GATE_PullDown_WL.1 R_GateON_WL.1
NetC_RJ451_RD1_2: C_RJ451_RD1.2 C_RJ451_RD2.2 Connector_RJ451.5(RD~)
NetC_RJ451_TD1_2: C_RJ451_TD1.2 C_RJ451_TD2.2 Connector_RJ451.4(TD~)
NetC_RJ452_RD1_2: C_RJ452_RD1.2 C_RJ452_RD2.2 Connector_RJ452.5(RD~)
NetC_RJ452_TD1_2: C_RJ452_TD1.2 C_RJ452_TD2.2 Connector_RJ452.4(TD~)

Not connected (* = marked no-connect by the designer): Connector_ENC1 1 2 7 8 SH; Connector_ENC2 1 2 7 8 SH; Connector_RJ451 7(NC); Connector_RJ452 7(NC); CPU A2(RSVD1) A4(WKUP_UART0_RTS_N) A5(MCU_UART0_TXD) A6(MCU_UART0_CTS_N) A7(MCU_SPI0_CLK) A8(MCU_I2C0_SCL) A9(WKUP_I2C0_SDA) A10(TCK)* A11(TDI)* A12(WKUP_CLKOUT0) A13(SPI0_CS0) A14(SPI0_CLK) A23(MMC2_SDCD) AA5(OLDI0_A0N) AA7(OLDI0_A3P) AA8(OLDI0_A2P) AA12(RSVD6) AA14(CSI0_RXRCALIB) AA15(RGMII1_RD3) AA21(PRG0_PRU1_GPIO14) AA23(PRG0_PRU1_GPIO10) AA24(PRG0_PRU1_GPIO12) AA25(PRG0_PRU1_GPIO7) AB4(OLDI0_A1P) AB6(OLDI0_A3N) AB10(USB1_VBUS) AB12(CSI0_RXN3) AB14(CSI0_RXN0) AB16(RGMII1_RD2) AB24(PRG0_PRU1_GPIO15) AB25(PRG0_PRU1_GPIO11) AC5(OLDI0_A4P) AC6(OLDI0_A4N) AC9(USB1_RCALIB) AC11(USB0_VBUS) AC13(CSI0_RXP3) AC15(CSI0_RXP0) AC20(RGMII2_TD3) AC21(RGMII2_RD2) AC24(PRG0_PRU1_GPIO19) AC25(PRG0_PRU1_GPIO1~{8}) AD3(OLDI0_A1N) AD4(OLDI0_CLK0N) AD5(OLDI0_CLK1P) AD6(OLDI0_A5P) AD7(OLDI0_A6P) AD8(OLDI0_A7N) AD10(USB1_DM) AD11(USB0_DP) AD13(CSI0_RXN2) AD14(CSI0_RXN1) AD15(CSI0_RXCLKN) AD18(RGMII1_TD3) AD21(RGMII2_TD2) AE2(RSVD3) AE3(OLDI0_CLK0P) AE4(OLDI0_CLK1N) AE5(OLDI0_A5N) AE6(OLDI0_A6N) AE7(OLDI0_A7P) AE9(USB1_DP) AE10(USB0_RCALIB) AE11(USB0_DM) AE13(CSI0_RXP2) AE14(CSI0_RXP1) AE15(CSI0_RXCLKP) AE18(RGMII1_TD2) AE22(RGMII2_RD3) B1(RSVD0) B3(MCU_MCAN0_RX) B4(WKUP_UART0_RXD) B5(MCU_UART0_RXD) B6(MCU_UART0_RTS_N) B7(PMIC_LPM_EN0) B8(MCU_SPI0_CS1) B9(WKUP_I2C0_SCL) B10(TRST_N)* B11(TMS)* B12(MCU_RESETSTATZ) B13(SPI0_D0) B14(SPI0_D1) B18(MCASP0_AXR1) B19(MCASP0_AXR3) B20(MCASP0_ACLKX) B23(MMC2_SDWP) B24(MMC2_DAT0) C1(WKUP_LFOSC0_XO)* C5(WKUP_UART0_TXD) C6(WKUP_UART0_CTS_N) C9(MCU_SPI0_D1) C11(EMU1)* C13(SPI0_CS1) C15(MCAN0_TX) C20(USB0_DRVVBUS) C24(MMC2_CMD) C25(MMC2_DAT1) D1(MCU_ERRORN) D4(MCU_MCAN1_RX) D6(MCU_MCAN0_TX) D9(MCU_SPI0_D0) D10(MCU_I2C0_SDA) D12(TDO)* D16(EXTINTN) D20(MCASP0_AFSX) D24(MMC2_DAT3) D25(MMC2_CLK) E5(MCU_MCAN1_TX) E7(RSVD8) E8(MCU_SPI0_CS0) E12(EMU0)* E15(MCAN0_RX) E18(MCASP0_AXR0) E23(MMC2_DAT2) E24(OSPI0_CS3_N) E25(OSPI0_D0) F6(RSVD2) F18(USB1_DRVVBUS) F23(OSPI0_CS0_N) F24(OSPI0_D3) F25(OSPI0_D2) G21(OSPI0_CS1_N) G24(OSPI0_D1) G25(OSPI0_LBCLKO) H21(OSPI0_CS2_N) H24(OSPI0_CLK) H25(OSPI0_D6) J8(VPP) J22(OSPI0_D7) J23(OSPI0_D4) J24(OSPI0_DQS) J25(OSPI0_D5) K25(PRG0_PRU0_GPIO15) L21(PRG0_PRU0_GPIO18) L23(PRG0_PRU0_GPIO9) L24(PRG0_PRU0_GPIO10) L25(PRG0_PRU0_GPIO11) M21(PRG0_PRU0_GPIO17) M22(PRG0_PRU0_GPIO16) M24(PRG0_PRU0_GPIO12) N20(PRG0_PRU0_GPIO13) P21(PRG0_PRU0_GPIO6) P25(PRG0_PRU0_GPIO8) R21(UART3_TX) R23(PRG0_PRU0_GPIO7) R24(UART2_RX) R25(UART2_TX) T2(RSVD4) T22(UART4_RX) T24(UART4_TX) T25(UART3_RX) U4(RSVD5) U22(PRG0_PRU1_GPIO0) U23(PRG0_PRU0_GPIO14) U24(UART5_TX) U25(UART5_RX) V20(PRG0_PRU1_GPIO9) V21(PRG0_PRU1_GPIO16) V24(PRG0_PRU1_GPIO1) V25(GPMC0_WAIT1) W21(PRG0_PRU1_GPIO8) W24(PRG0_PRU1_GPIO3) W25(PRG0_PRU1_GPIO2) Y6(OLDI0_A0P) Y8(OLDI0_A2N) Y15(RSVD7) Y20(PRG0_PRU1_GPIO17) Y22(PRG0_PRU1_GPIO13) Y23(PRG0_PRU1_GPIO6) Y24(PRG0_PRU1_GPIO5) Y25(PRG0_PRU1_GPIO4); EthernetPHY2 12(XO)*; EthernetPHY_1 12(XO)*; IGBT B EW GB T1 T2; IGBTDriver_U 7(NC) 12(NC) 13(NC); IGBTDriver_V 7(NC) 12(NC) 13(NC); IGBTDriver_W 7(NC) 12(NC) 13(NC); PMIC 8(GPO1) 9(SDA) 10(SCL) 11(INT_N) 16(GPIO) 19(VLDO2)* 20(PVIN_LDO2)* 28(MODE_RESET) 31(MODE_STBY); RS485_ENC_1 11(NC) 14(NC); RS485_ENC_2 11(NC) 14(NC)

### Layout directives
mark named RMII1: RMII1 CRS_DV, RMII1 RX_D0, RMII1 RX_D1, RMII1 RX_ER, RMII1 TX_D0, RMII1 TX_EN
mark named RMII2: RMII2 CRS_DV, RMII2 RX_D0, RMII2 RX_D1, RMII2 RX_ER, RMII2 TX_D0, RMII2 TX_EN
mark named MMC: MMC_CLK, MMC_CMD, MMC_D0, MMC_D1, MMC_D2, MMC_D3

### Notes on the sheet
- Input Supply
- DCDC Isolated Supply
- 2W 0.4A
- I5V Supply
- 3.3V Supply
- PMIC
- Clocks
- 60A 300W
- 3.3W 1A
- (near PMIC) PMIC 12W
- 3.5A
- 2.0A
- 0.4A
- 0.3A
- (near F_1.8V_Crystal) 0.0075A
- (near C_DCDC_I9V_OUT) 2W 0.16A
- (near F_ClockBuffer_RMII) 0.02A
- (near F_ADC) 0.04A
- (near C_DCDC_I9V_V_OUT) 2W 0.16A
- 2W 0.16A
- SOC
- SD Card
- 0.200A
- Ethernet
- (near F_EthernetPHY1) 0.064A
- 0.064A
- Encoders
- 0.010A
- 0.060A
- (near C_ADC_U-2) 0.006A
- (near C_ADC_U-4) 0.010A
- IGBT Control
- (near C_ADC_V-1) 0.006A
- (near C_ADC_W-1) 0.006A
- (near C_DriverU-2) 0.005A
- 0.006A
- (near C_DriverV-2) 0.005A
- (near C_DriverW-2) 0.005A
- (in symbol Button) PB